# EAGLE design Lab11_445L (EAGLE 9.6.2)
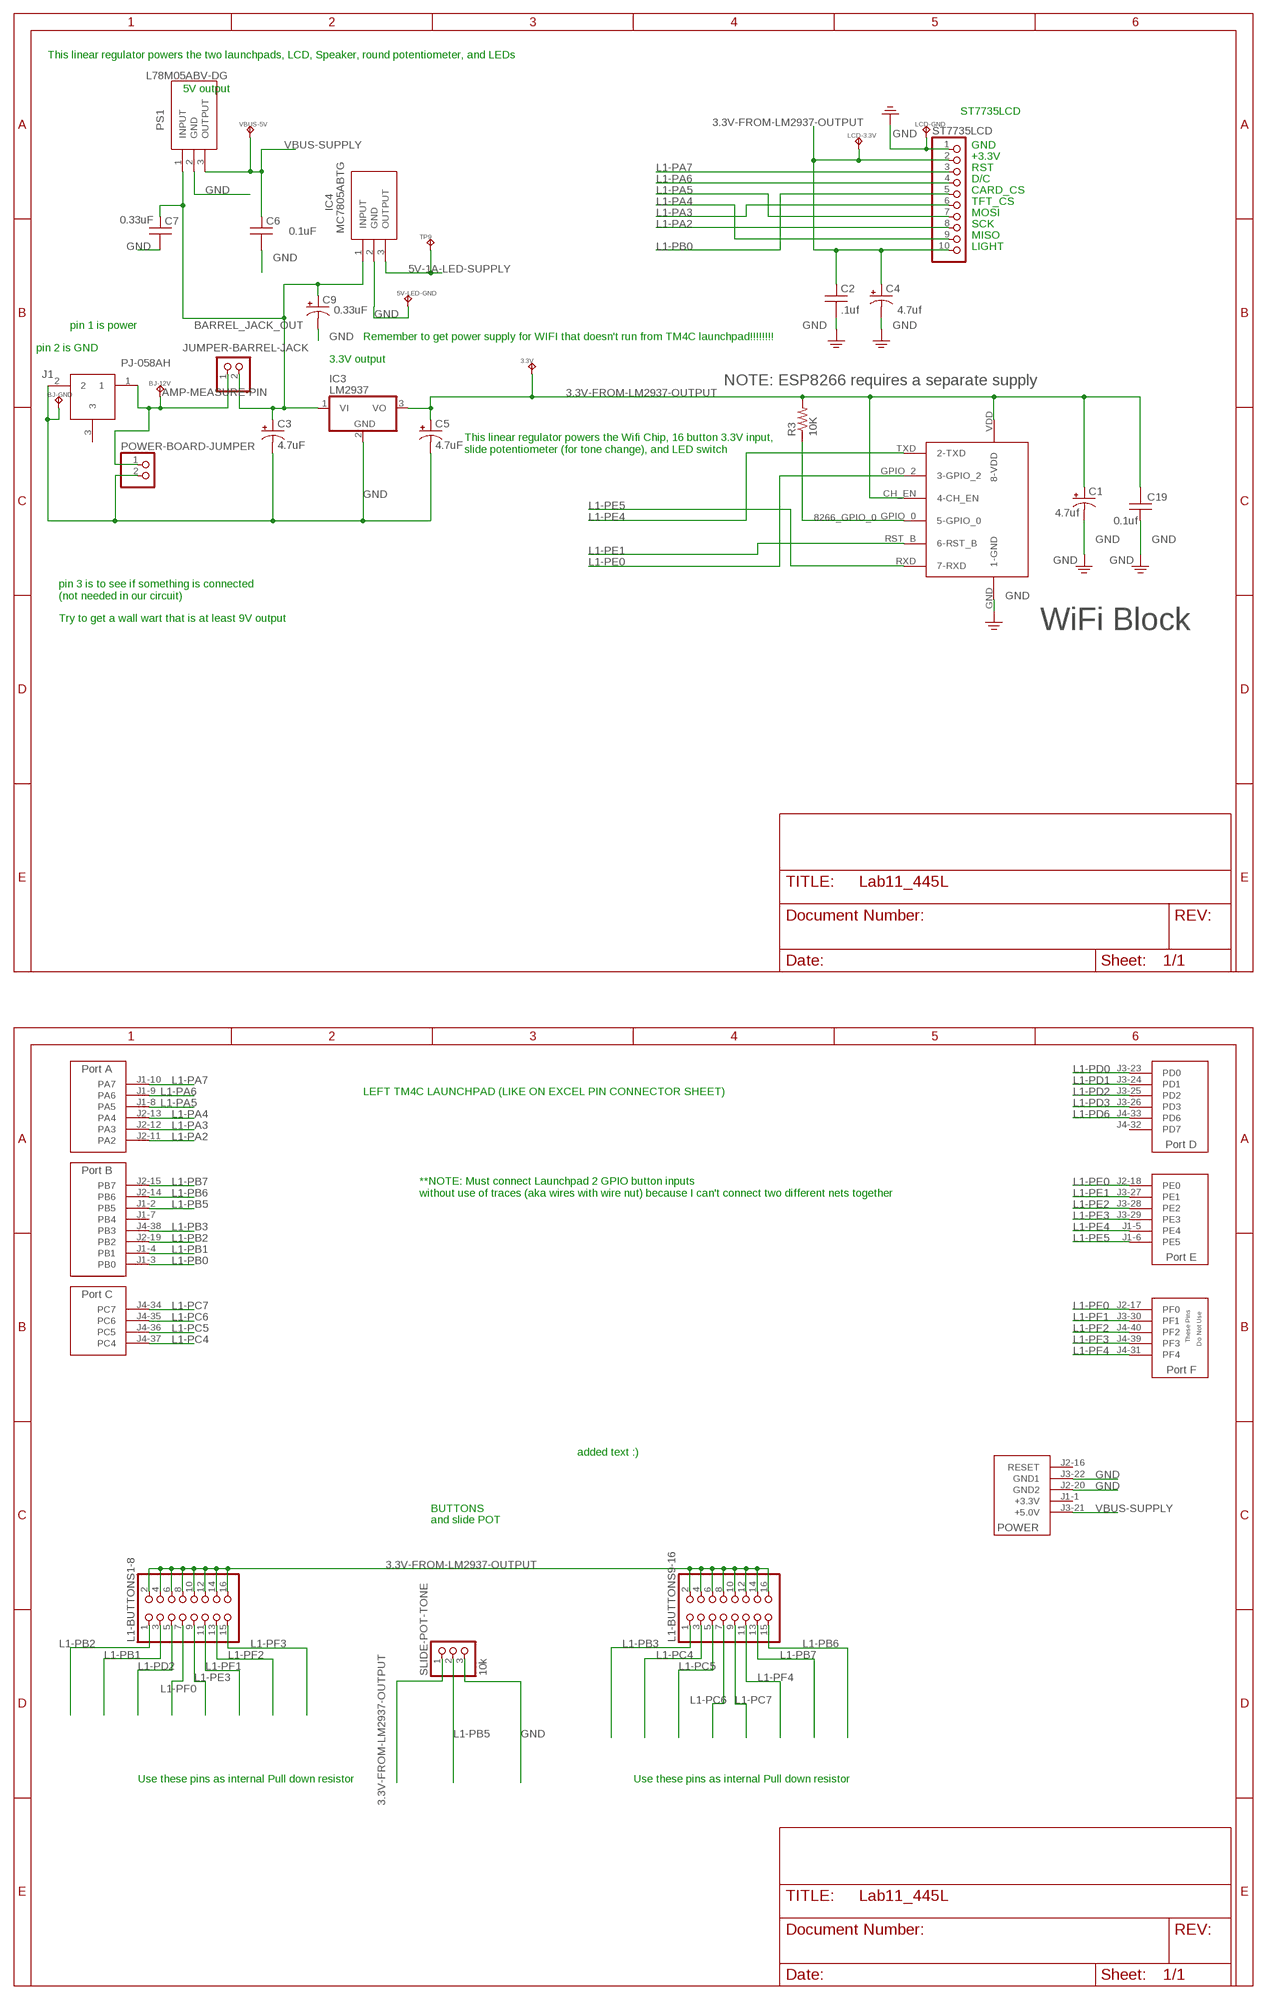
[diagram p0: schematic, sheet 1, part 1 of 2]
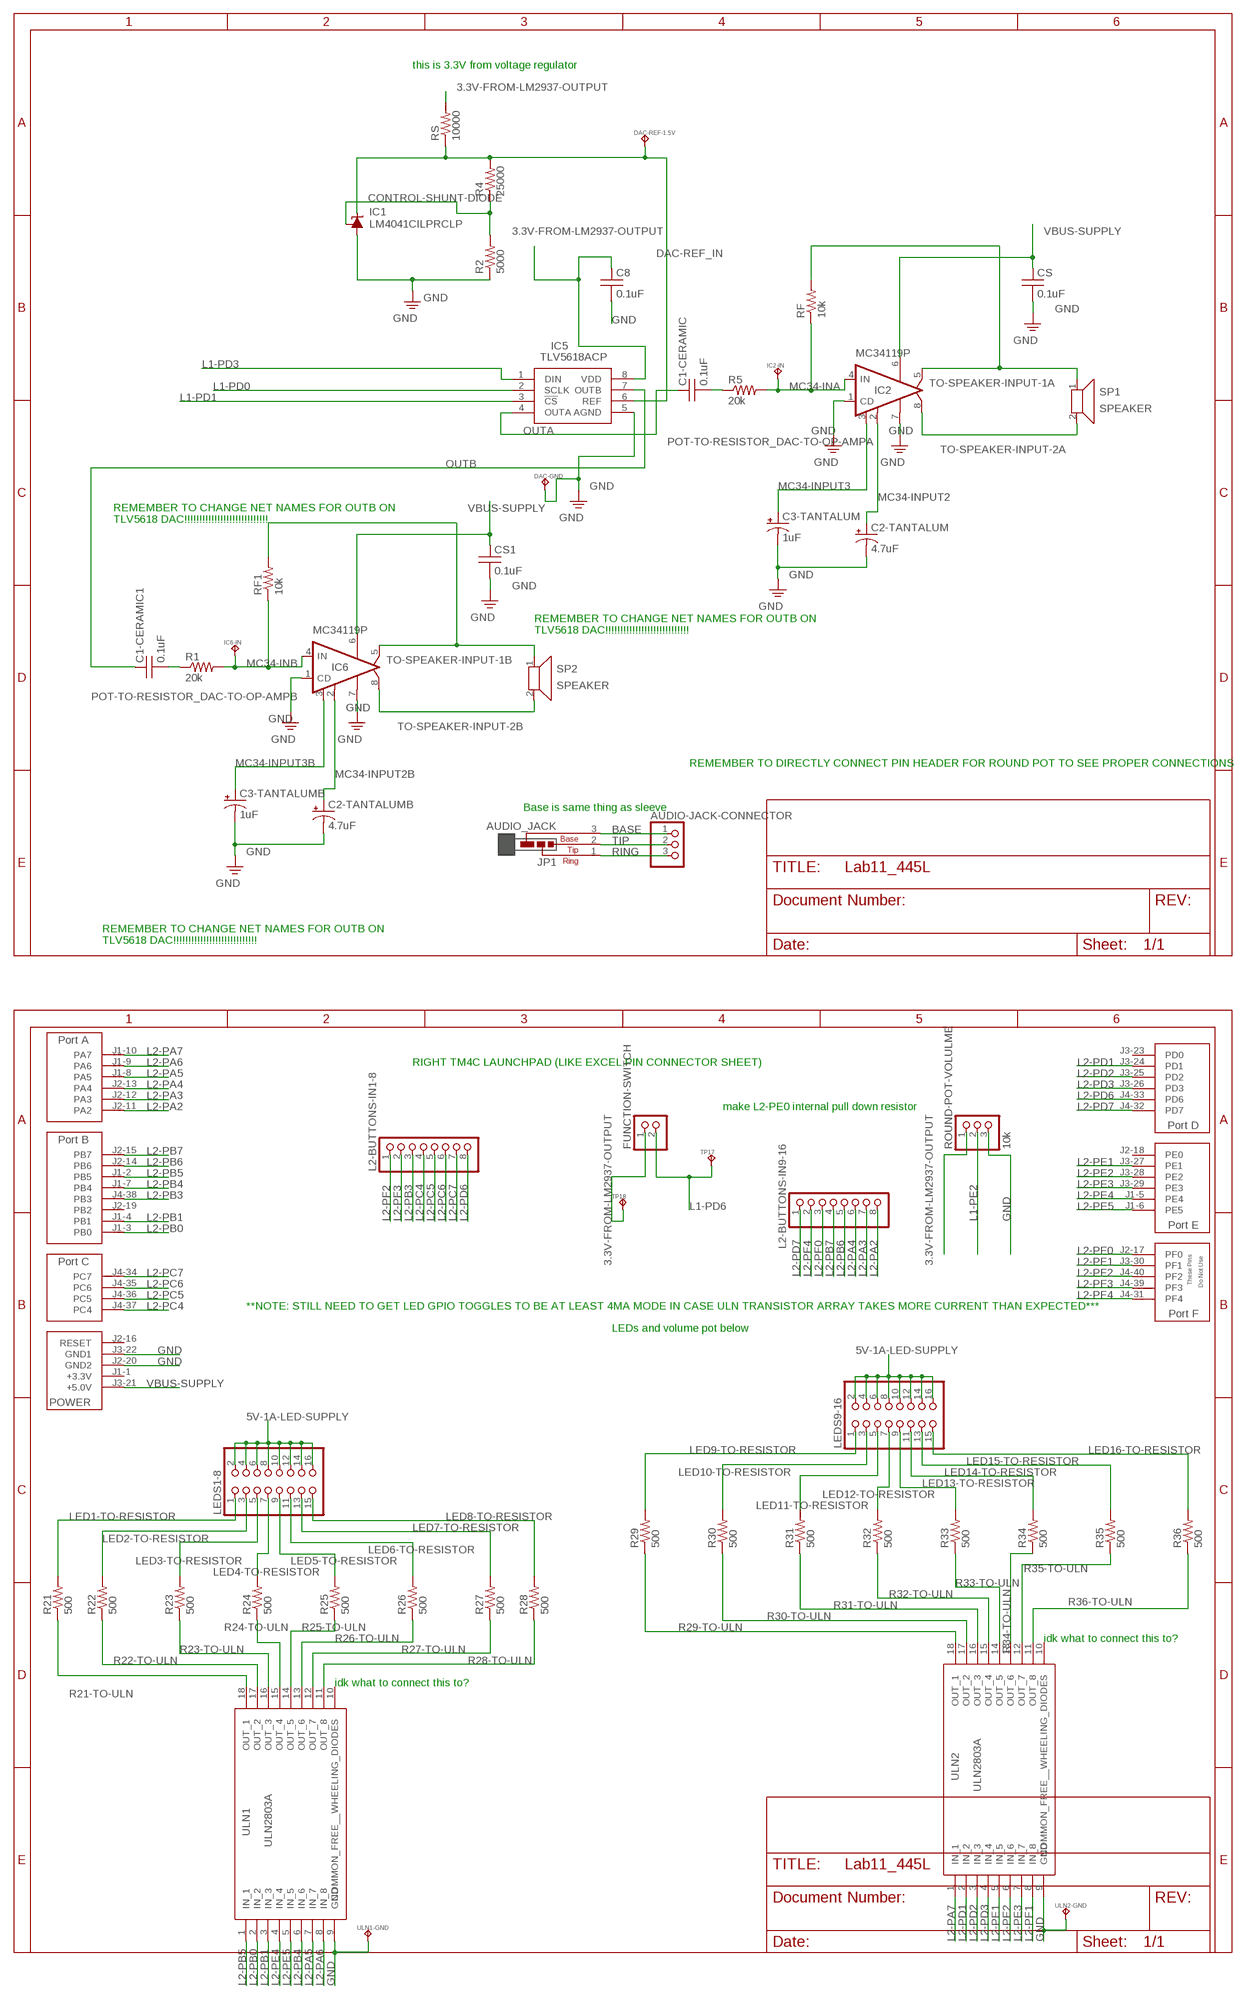
[diagram p1: schematic, sheet 1, part 2 of 2]

## Parts
3.3V  TP_KEYSTONE500X  [P1.1MM]
5V-LED-GND  TP_KEYSTONE500X  [P1.1MM]
AMP-MEASURE-PIN  PINHD-1X2  [1X02]
AUDIO-JACK-CONNECTOR  PINHD-1X3  [1X03]
BJ-12V  TP_KEYSTONE500X  [P1.1MM]
BJ-GND  TP_KEYSTONE500X  [P1.1MM]
C1  4.7uf  CAPACITOR_POLARIZEDE5-6  [CAP200MILPOLARIZED]
C1-CERAMIC  0.1uF  CAPACITOR025-024X044  [CAP100MIL]
C1-CERAMIC1  0.1uF  CAPACITOR025-024X044  [CAP100MIL]
C2  .1uf  CAPACITOR050-024X044  [CAP200MIL]
C2-TANTALUM  4.7uF  CAPACITOR_POLARIZEDE5-6  [CAP200MILPOLARIZED]
C2-TANTALUMB  4.7uF  CAPACITOR_POLARIZEDE5-6  [CAP200MILPOLARIZED]
C3  4.7uF  CAPACITOR_POLARIZEDE5-6  [CAP200MILPOLARIZED]
C3-TANTALUM  1uF  CAPACITOR_POLARIZEDE5-6  [CAP200MILPOLARIZED]
C3-TANTALUMB  1uF  CAPACITOR_POLARIZEDE5-6  [CAP200MILPOLARIZED]
C4  4.7uf  CAPACITOR_POLARIZEDE5-6  [CAP200MILPOLARIZED]
C5  4.7uF  CAPACITOR_POLARIZEDE5-6  [CAP200MILPOLARIZED]
C6  0.1uF  CAPACITOR050-024X044  [CAP200MIL]
C7  0.33uF  CAPACITOR050-024X044  [CAP200MIL]
C8  0.1uF  CAPACITOR025-024X044  [CAP100MIL]
C9  0.33uF  CAPACITOR_POLARIZEDE5-6  [CAP200MILPOLARIZED]
C19  0.1uf  CAPACITOR050-024X044  [CAP200MIL]
CS  0.1uF  CAPACITOR025-024X044  [CAP100MIL]
CS1  0.1uF  CAPACITOR025-024X044  [CAP100MIL]
DAC-GND  TP_KEYSTONE500X  [P1.1MM]
DAC-REF-1.5V  TP_KEYSTONE500X  [P1.1MM]
FUNCTION-SWITCH  PINHD-1X2  [1X02]
IC1  LM4041CILPRCLP  [LP_O-PBCY-W3]
IC2  MC34119P  [DIL08]
IC2-IN  TP_KEYSTONE500X  [P1.1MM]
IC3  LM2937  [TO220]
IC4  MC7805ABTG  [TO254P482X997X2018-3P]
IC5  TLV5618ACP  [DIP794W53P254L959H508Q8N]
IC6  MC34119P  [DIL08]
IC6-IN  TP_KEYSTONE500X  [P1.1MM]
J1  PJ-058AH  [PJ058AH]
JP1  AUDIO_JACK  [JACK]
L1-BUTTONS1-8  PINHD-2X8  [2X08]
L1-BUTTONS9-16  PINHD-2X8  [2X08]
L2-BUTTONS-IN1-8  PINHD-1X8  [1X08]
L2-BUTTONS-IN9-16  PINHD-1X8  [1X08]
LCD-3.3V  TP_KEYSTONE500X  [P1.1MM]
LCD-GND  TP_KEYSTONE500X  [P1.1MM]
LEDS1-8  PINHD-2X8  [2X08]
LEDS9-16  PINHD-2X8  [2X08]
POWER-BOARD-JUMPER  PINHD-1X2  [1X02]
PS1  L78M05ABV-DG  [TO255P460X1020X2008-3P]
R1  20k  RESISTOR0204/5  [RES200MIL]
R2  5000  RESISTOR0204/5  [RES200MIL]
R3  10K  RESISTOR0204/7  [RES300MIL]
R4  25000  RESISTOR0204/5  [RES200MIL]
R5  20k  RESISTOR0204/5  [RES200MIL]
R21  500  RESISTOR0204/7  [RES300MIL]
R22  500  RESISTOR0204/7  [RES300MIL]
R23  500  RESISTOR0204/7  [RES300MIL]
R24  500  RESISTOR0204/7  [RES300MIL]
R25  500  RESISTOR0204/7  [RES300MIL]
R26  500  RESISTOR0204/7  [RES300MIL]
R27  500  RESISTOR0204/7  [RES300MIL]
R28  500  RESISTOR0204/7  [RES300MIL]
R29  500  RESISTOR0204/7  [RES300MIL]
R30  500  RESISTOR0204/7  [RES300MIL]
R31  500  RESISTOR0204/7  [RES300MIL]
R32  500  RESISTOR0204/7  [RES300MIL]
R33  500  RESISTOR0204/7  [RES300MIL]
R34  500  RESISTOR0204/7  [RES300MIL]
R35  500  RESISTOR0204/7  [RES300MIL]
R36  500  RESISTOR0204/7  [RES300MIL]
RF  10k  RESISTOR0204/5  [RES200MIL]
RF1  10k  RESISTOR0204/5  [RES200MIL]
ROUND-POT-VOLULME  10k  PINHD-1X3  [1X03]
RS  10000  RESISTOR0204/5  [RES200MIL]
SLIDE-POT-TONE  10k  PINHD-1X3  [1X03]
SP1  SPEAKER  [1X02]
SP2  SPEAKER  [1X02]
ST7735LCD  PINHD-1X10  [1X10]
TP9  TP_KEYSTONE500X  [P1.1MM]
TP17  TP_KEYSTONE500X  [P1.1MM]
TP18  TP_KEYSTONE500X  [P1.1MM]
U$1  ESP_8266  [ESP8266]
U$2  TM4C_BP  [TM4C_BOOSTER_PACK]
U$3  TM4C_BP  [TM4C_BOOSTER_PACK]
ULN1  ULN2803A  [DIP850W46P254L2324H393Q18N]
ULN1-GND  TP_KEYSTONE500X  [P1.1MM]
ULN2  ULN2803A  [DIP850W46P254L2324H393Q18N]
ULN2-GND  TP_KEYSTONE500X  [P1.1MM]
VBUS-5V  TP_KEYSTONE500X  [P1.1MM]

## Nets
3.3V-FROM-LM2937-OUTPUT: 3.3V.TP C1.+ C2.1 C4.+ C5.+ C8.1 C19.2 FUNCTION-SWITCH.1 IC3.3(VO) IC5.8(VDD) L1-BUTTONS1-8.2 L1-BUTTONS1-8.4 L1-BUTTONS1-8.6 L1-BUTTONS1-8.8 L1-BUTTONS1-8.10 L1-BUTTONS1-8.12 L1-BUTTONS1-8.14 L1-BUTTONS1-8.16 L1-BUTTONS9-16.2 L1-BUTTONS9-16.4 L1-BUTTONS9-16.6 L1-BUTTONS9-16.8 L1-BUTTONS9-16.10 L1-BUTTONS9-16.12 L1-BUTTONS9-16.14 L1-BUTTONS9-16.16 LCD-3.3V.TP R3.2 ROUND-POT-VOLULME.1 RS.2 SLIDE-POT-TONE.1 ST7735LCD.2 ST7735LCD.10 TP18.TP U$1.CH_EN(4-CH_EN) U$1.VDD(8-VDD)
5V-1A-LED-SUPPLY: IC4.3(OUTPUT) LEDS1-8.2 LEDS1-8.4 LEDS1-8.6 LEDS1-8.8 LEDS1-8.10 LEDS1-8.12 LEDS1-8.14 LEDS1-8.16 LEDS9-16.2 LEDS9-16.4 LEDS9-16.6 LEDS9-16.8 LEDS9-16.10 LEDS9-16.12 LEDS9-16.14 LEDS9-16.16 TP9.TP
8266_GPIO_0: R3.1 U$1.GPIO_0(5-GPIO_0)
BARREL_JACK_OUT: AMP-MEASURE-PIN.1 BJ-12V.TP J1.1 POWER-BOARD-JUMPER.1
BASE: AUDIO-JACK-CONNECTOR.1 JP1.3(BASE)
CONTROL-SHUNT-DIODE: IC1.1(FB) R2.2 R4.1
DAC-REF_IN: DAC-REF-1.5V.TP IC1.2(C) IC5.6(REF) R4.2 RS.1
GND: 5V-LED-GND.TP BJ-GND.TP C1.- C2-TANTALUM.- C2-TANTALUMB.- C2.2 C3-TANTALUM.- C3-TANTALUMB.- C3.- C4.- C5.- C6.2 C7.2 C8.2 C9.- C19.1 CS1.2 CS.2 DAC-GND.TP IC1.3(A) IC2.1(CD) IC2.7(GND) IC3.2(GND) IC4.2(GND) IC5.5(AGND) IC6.1(CD) IC6.7(GND) J1.2 LCD-GND.TP POWER-BOARD-JUMPER.2 PS1.2(GND) R2.1 ROUND-POT-VOLULME.3 SLIDE-POT-TONE.3 ST7735LCD.1 U$1.GND(1-GND) U$2.J2-20(GND2) U$2.J3-22(GND1) U$3.J2-20(GND2) U$3.J3-22(GND1) ULN1-GND.TP ULN1.9(GND) ULN2-GND.TP ULN2.9(GND)
JUMPER-BARREL-JACK: AMP-MEASURE-PIN.2 C3.+ C7.1 C9.+ IC3.1(VI) IC4.1(INPUT) PS1.1(INPUT)
L1-PA2: ST7735LCD.8 U$2.J2-11(PA2)
L1-PA3: ST7735LCD.6 U$2.J2-12(PA3)
L1-PA4: ST7735LCD.9 U$2.J2-13(PA4)
L1-PA5: ST7735LCD.7 U$2.J1-8(PA5)
L1-PA6: ST7735LCD.4 U$2.J1-9(PA6)
L1-PA7: ST7735LCD.3 U$2.J1-10(PA7)
L1-PB0: ST7735LCD.5 U$2.J1-3(PB0)
L1-PB1: L1-BUTTONS1-8.3 U$2.J1-4(PB1)
L1-PB2: L1-BUTTONS1-8.1 U$2.J2-19(PB2)
L1-PB3: L1-BUTTONS9-16.1 U$2.J4-38(PB3)
L1-PB5: SLIDE-POT-TONE.2 U$2.J1-2(PB5)
L1-PB6: L1-BUTTONS9-16.15 U$2.J2-14(PB6)
L1-PB7: L1-BUTTONS9-16.13 U$2.J2-15(PB7)
L1-PC4: L1-BUTTONS9-16.3 U$2.J4-37(PC4)
L1-PC5: L1-BUTTONS9-16.5 U$2.J4-36(PC5)
L1-PC6: L1-BUTTONS9-16.7 U$2.J4-35(PC6)
L1-PC7: L1-BUTTONS9-16.9 U$2.J4-34(PC7)
L1-PD0: IC5.2(SCLK) U$2.J3-23(PD0)
L1-PD1: IC5.3(!CS) U$2.J3-24(PD1)
L1-PD2: L1-BUTTONS1-8.5 U$2.J3-25(PD2)
L1-PD3: IC5.1(DIN) U$2.J3-26(PD3)
L1-PD6: FUNCTION-SWITCH.2 TP17.TP U$2.J4-33(PD6)
L1-PE0: U$1.GPIO_2(3-GPIO_2) U$2.J2-18(PE0)
L1-PE1: U$1.RST_B(6-RST_B) U$2.J3-27(PE1)
L1-PE2: ROUND-POT-VOLULME.2 U$2.J3-28(PE2)
L1-PE3: L1-BUTTONS1-8.9 U$2.J3-29(PE3)
L1-PE4: U$1.TXD(2-TXD) U$2.J1-5(PE4)
L1-PE5: U$1.RXD(7-RXD) U$2.J1-6(PE5)
L1-PF0: L1-BUTTONS1-8.7 U$2.J2-17(PF0)
L1-PF1: L1-BUTTONS1-8.11 U$2.J3-30(PF1)
L1-PF2: L1-BUTTONS1-8.13 U$2.J4-40(PF2)
L1-PF3: L1-BUTTONS1-8.15 U$2.J4-39(PF3)
L1-PF4: L1-BUTTONS9-16.11 U$2.J4-31(PF4)
L2-PA2: L2-BUTTONS-IN9-16.8 U$3.J2-11(PA2)
L2-PA3: L2-BUTTONS-IN9-16.7 U$3.J2-12(PA3)
L2-PA4: L2-BUTTONS-IN9-16.6 U$3.J2-13(PA4)
L2-PA5: U$3.J1-8(PA5) ULN1.7(IN_7)
L2-PA6: U$3.J1-9(PA6) ULN1.8(IN_8)
L2-PA7: U$3.J1-10(PA7) ULN2.1(IN_1)
L2-PB0: U$3.J1-3(PB0) ULN1.2(IN_2)
L2-PB1: U$3.J1-4(PB1) ULN1.3(IN_3)
L2-PB3: L2-BUTTONS-IN1-8.3 U$3.J4-38(PB3)
L2-PB4: U$3.J1-7(PB4) ULN1.6(IN_6)
L2-PB5: U$3.J1-2(PB5) ULN1.1(IN_1)
L2-PB6: L2-BUTTONS-IN9-16.5 U$3.J2-14(PB6)
L2-PB7: L2-BUTTONS-IN9-16.4 U$3.J2-15(PB7)
L2-PC4: L2-BUTTONS-IN1-8.4 U$3.J4-37(PC4)
L2-PC5: L2-BUTTONS-IN1-8.5 U$3.J4-36(PC5)
L2-PC6: L2-BUTTONS-IN1-8.6 U$3.J4-35(PC6)
L2-PC7: L2-BUTTONS-IN1-8.7 U$3.J4-34(PC7)
L2-PD1: U$3.J3-24(PD1) ULN2.2(IN_2)
L2-PD2: U$3.J3-25(PD2) ULN2.3(IN_3)
L2-PD3: U$3.J3-26(PD3) ULN2.4(IN_4)
L2-PD6: L2-BUTTONS-IN1-8.8 U$3.J4-33(PD6)
L2-PD7: L2-BUTTONS-IN9-16.1 U$3.J4-32(PD7)
L2-PE1: U$3.J3-27(PE1) ULN2.5(IN_5)
L2-PE2: U$3.J3-28(PE2) ULN2.6(IN_6)
L2-PE3: U$3.J3-29(PE3) ULN2.7(IN_7)
L2-PE4: U$3.J1-5(PE4) ULN1.4(IN_4)
L2-PE5: U$3.J1-6(PE5) ULN1.5(IN_5)
L2-PF0: L2-BUTTONS-IN9-16.3 U$3.J2-17(PF0)
L2-PF1: U$3.J3-30(PF1) ULN2.8(IN_8)
L2-PF2: L2-BUTTONS-IN1-8.1 U$3.J4-40(PF2)
L2-PF3: L2-BUTTONS-IN1-8.2 U$3.J4-39(PF3)
L2-PF4: L2-BUTTONS-IN9-16.2 U$3.J4-31(PF4)
LED1-TO-RESISTOR: LEDS1-8.1 R21.2
LED2-TO-RESISTOR: LEDS1-8.3 R22.2
LED3-TO-RESISTOR: LEDS1-8.5 R23.2
LED4-TO-RESISTOR: LEDS1-8.7 R24.2
LED5-TO-RESISTOR: LEDS1-8.9 R25.2
LED6-TO-RESISTOR: LEDS1-8.11 R26.2
LED7-TO-RESISTOR: LEDS1-8.13 R27.2
LED8-TO-RESISTOR: LEDS1-8.15 R28.2
LED9-TO-RESISTOR: LEDS9-16.1 R29.2
LED10-TO-RESISTOR: LEDS9-16.3 R30.2
LED11-TO-RESISTOR: LEDS9-16.5 R31.2
LED12-TO-RESISTOR: LEDS9-16.7 R32.2
LED13-TO-RESISTOR: LEDS9-16.9 R33.2
LED14-TO-RESISTOR: LEDS9-16.11 R34.2
LED15-TO-RESISTOR: LEDS9-16.13 R35.2
LED16-TO-RESISTOR: LEDS9-16.15 R36.2
MC34-INA: IC2-IN.TP IC2.4(IN) R5.2 RF.1
MC34-INB: IC6-IN.TP IC6.4(IN) R1.2 RF1.1
MC34-INPUT2: C2-TANTALUM.+ IC2.2(FC2)
MC34-INPUT2B: C2-TANTALUMB.+ IC6.2(FC2)
MC34-INPUT3: C3-TANTALUM.+ IC2.3(FC1)
MC34-INPUT3B: C3-TANTALUMB.+ IC6.3(FC1)
OUTA: C1-CERAMIC.1 IC5.4(OUTA)
OUTB: C1-CERAMIC1.1 IC5.7(OUTB)
POT-TO-RESISTOR_DAC-TO-OP-AMPA: C1-CERAMIC.2 R5.1
POT-TO-RESISTOR_DAC-TO-OP-AMPB: C1-CERAMIC1.2 R1.1
R21-TO-ULN: R21.1 ULN1.18(OUT_1)
R22-TO-ULN: R22.1 ULN1.17(OUT_2)
R23-TO-ULN: R23.1 ULN1.16(OUT_3)
R24-TO-ULN: R24.1 ULN1.15(OUT_4)
R25-TO-ULN: R25.1 ULN1.14(OUT_5)
R26-TO-ULN: R26.1 ULN1.13(OUT_6)
R27-TO-ULN: R27.1 ULN1.12(OUT_7)
R28-TO-ULN: R28.1 ULN1.11(OUT_8)
R29-TO-ULN: R29.1 ULN2.18(OUT_1)
R30-TO-ULN: R30.1 ULN2.17(OUT_2)
R31-TO-ULN: R31.1 ULN2.16(OUT_3)
R32-TO-ULN: R32.1 ULN2.15(OUT_4)
R33-TO-ULN: R33.1 ULN2.14(OUT_5)
R34-TO-ULN: R34.1 ULN2.13(OUT_6)
R35-TO-ULN: R35.1 ULN2.12(OUT_7)
R36-TO-ULN: R36.1 ULN2.11(OUT_8)
RING: AUDIO-JACK-CONNECTOR.3 JP1.1(RING)
TIP: AUDIO-JACK-CONNECTOR.2 JP1.2(TIP)
TO-SPEAKER-INPUT-1A: IC2.5(VO1) RF.2 SP1.1
TO-SPEAKER-INPUT-1B: IC6.5(VO1) RF1.2 SP2.1
TO-SPEAKER-INPUT-2A: IC2.8(VO2) SP1.2
TO-SPEAKER-INPUT-2B: IC6.8(VO2) SP2.2
VBUS-SUPPLY: C6.1 CS1.1 CS.1 IC2.6(VCC) IC6.6(VCC) PS1.3(OUTPUT) U$2.J3-21(+5.0V) U$3.J3-21(+5.0V) VBUS-5V.TP
Unconnected: J1.3 U$2.J1-1(+3.3V) U$2.J1-7(PB4) U$2.J2-16(RESET) U$2.J4-32(PD7) U$3.J1-1(+3.3V) U$3.J2-16(RESET) U$3.J2-18(PE0) U$3.J2-19(PB2) U$3.J3-23(PD0) ULN1.10(COMMON_FREE__WHEELING_DIODES) ULN2.10(COMMON_FREE__WHEELING_DIODES)

## Notes on the sheet
- This linear regulator powers the two launchpads, LCD, Speaker, round potentiometer, and LEDs
- this is 3.3V from voltage regulator
- 5V output
- ST7735LCD
- GND
- +3.3V
- RST
- D/C
- CARD_CS
- TFT_CS
- MOSI
- SCK
- MISO
- LIGHT
- pin 1 is power
- Remember to get power supply for WIFI that doesn't run from TM4C launchpad!!!!!!!!
- pin 2 is GND
- 3.3V output
- NOTE: ESP8266 requires a separate supply
- This linear regulator powers the Wifi Chip, 16 button 3.3V input, 
  slide potentiometer (for tone change), and LED switch
- REMEMBER TO CHANGE NET NAMES FOR OUTB ON 
  TLV5618 DAC!!!!!!!!!!!!!!!!!!!!!!!!!!!!
- pin 3 is to see if something is connected 
  (not needed in our circuit)
- Try to get a wall wart that is at least 9V output
- WiFi Block
- REMEMBER TO CHANGE NET NAMES FOR OUTB ON 
  TLV5618 DAC!!!!!!!!!!!!!!!!!!!!!!!!!!!!
- REMEMBER TO DIRECTLY CONNECT PIN HEADER FOR ROUND POT TO SEE PROPER CONNECTIONS
- Base is same thing as sleeve
- REMEMBER TO CHANGE NET NAMES FOR OUTB ON 
  TLV5618 DAC!!!!!!!!!!!!!!!!!!!!!!!!!!!!
- RIGHT TM4C LAUNCHPAD (LIKE EXCEL PIN CONNECTOR SHEET)
- LEFT TM4C LAUNCHPAD (LIKE ON EXCEL PIN CONNECTOR SHEET)
- make L2-PE0 internal pull down resistor
- **NOTE: Must connect Launchpad 2 GPIO button inputs 
  without use of traces (aka wires with wire nut) because I can't connect two different nets together
- **NOTE: STILL NEED TO GET LED GPIO TOGGLES TO BE AT LEAST 4MA MODE IN CASE ULN TRANSISTOR ARRAY TAKES MORE CURRENT THAN EXPECTED***
- LEDs and volume pot below
- added text :)
- BUTTONS
- and slide POT
- idk what to connect this to?
- idk what to connect this to?
- Use these pins as internal Pull down resistor | Use these pins as internal Pull down resistor

## Library data of the parts
3.3V 5V-LED-GND BJ-12V BJ-GND DAC-GND DAC-REF-1.5V IC2-IN IC6-IN LCD-3.3V LCD-GND TP9 TP17 TP18 ULN1-GND ULN2-GND VBUS-5V = EE445L:TP: Test pad Test point, black, Keystone Electronics 5001, Digikey 5001K-ND Test point, orange, Keystone Electronics 5003, Digikey 5003K-ND Test point, yellow, Keystone Electronics 5004, Digikey 5004K-ND Test point, white, Keystone Electronics 5002, Digikey 5002K-ND Test point, red, Keystone Electronics 5000, Digikey 5000K-ND
AMP-MEASURE-PIN FUNCTION-SWITCH POWER-BOARD-JUMPER = EE445L:PINHD-1X2: PIN HEADER
AUDIO-JACK-CONNECTOR ROUND-POT-VOLULME SLIDE-POT-TONE = EE445L:PINHD-1X3: PIN HEADER
C1 C2-TANTALUM C2-TANTALUMB C3 C3-TANTALUM C3-TANTALUMB C4 C5 C9 = EE445L:CAPACITOR_POLARIZED: POLARIZED CAPACITOR, American symbol
C1-CERAMIC C1-CERAMIC1 C2 C6-C8 C19 CS CS1 = EE445L:CAPACITOR: CAPACITOR, American symbol
IC1 = EE445L:LM4041CILPR: PRECISION MICROPOWER SHUNT VOLTAGE REFERENCE Adjustable Output Source: http://focus.ti.com/lit/ds/slcs146e/slcs146e.pdf LM4041CILPR Let R1 be the resistor from Vref to +3.3V Let R2 be the resistor from Vref to FB Let R3 be the resistor from FB to ground Vref = 1.23*(1+R3/R2) Iref=(3.3V-Vref)/R1 - 100uA; MPN: LM4041CILP; OC_FARNELL: 1673945; OC_NEWARK: 50M8856
IC2 IC6 = EE445L:MC34119: Low Power Audio Amplifier Motorola
IC3 = EE445L:LM2937: LM2937-2.5, LM2937-3.3 400mA and 500mA Voltage Regulators Source: http://cache.national.com/ds/LM/LM2937-2.5.pdf
IC4 = MC7805ABTG:MC7805ABTG: Voltage Regulator 1A 5V 2% 35Vin TO-220 ON Semiconductor MC7805ABTG, Single Linear Voltage Regulator, 1A 5 V, +/-2%, 3-Pin TO-220 Source: Datasheet <http://www.onsemi.com/pub/Collateral/MC7800-D.PDF>; DESCRIPTION: Voltage Regulator 1A 5V 2% 35Vin TO-220 ON Semiconductor MC7805ABTG, Single Linear Voltage Regulator, 1A 5 V, +/-2%, 3-Pin TO-220; HEIGHT: 4.82mm; MANUFACTURER_NAME: ON Semiconductor; MANUFACTURER_PART_NUMBER: MC7805ABTG; MOUSER_PART_NUMBER: 863-MC7805ABTG; MOUSER_PRICE-STOCK: https://www.mouser.co.uk/ProductDetail/onsemi/MC7805ABTG?qs=%252B9%2Fcbd0IE0RLGUepYBL%2Fmg%3D%3D
IC5 = TLV5618ACP:TLV5618ACP: 12-Bit, 2.5 us Dual DAC, Serial Input, Pgrmable Settling Time, Q temp available Source: Datasheet <http://www.ti.com/lit/ds/symlink/tlv5618a.pdf>; DESCRIPTION: 12-Bit, 2.5 us Dual DAC, Serial Input, Pgrmable Settling Time, Q temp available; HEIGHT: 5.08mm; MANUFACTURER_NAME: Texas Instruments; MANUFACTURER_PART_NUMBER: TLV5618ACP; MOUSER_PART_NUMBER: 595-TLV5618ACP; MOUSER_PRICE-STOCK: https://www.mouser.co.uk/ProductDetail/Texas-Instruments/TLV5618ACP?qs=m96fseALk3UtMGk%252BxtLEkA%3D%3D
J1 = PJ-058AH:PJ-058AH: DC Power Connectors Power Jacks Source: Datasheet <http://www.cui.com/product/resource/digikeypdf/pj-058ah.pdf>; DESCRIPTION: DC Power Connectors Power Jacks; HEIGHT: 11mm; MANUFACTURER_NAME: CUI Inc.; MANUFACTURER_PART_NUMBER: PJ-058AH; MOUSER_PART_NUMBER: 490-PJ-058AH; MOUSER_PRICE-STOCK: https://www.mouser.co.uk/ProductDetail/CUI-Devices/PJ-058AH?qs=WyjlAZoYn53EeE%252BXtzGmBw%3D%3D
JP1 = EE445L:AUDIO_JACK: Audio Jack Stereo Jack 3pin 3.5mm, CUI, SJ1-3553NG, CP1-3553NG-ND; OC_FARNELL: unknown; OC_NEWARK: unknown
L1-BUTTONS1-8 L1-BUTTONS9-16 LEDS1-8 LEDS9-16 = EE445L:PINHD-2X8: PIN HEADER
L2-BUTTONS-IN1-8 L2-BUTTONS-IN9-16 = EE445L:PINHD-1X8: PIN HEADER
PS1 = L78M05ABV-DG:L78M05ABV-DG: 5V Precision 500mA Regulator TO-220 STMicroelectronics L78Mxx L78M05ABV-DG, Single Linear Voltage Regulator, 350mA 5.2 V, 3-Pin TO-220 Source: Datasheet <https://componentsearchengine.com/Datasheets/1/L78M05ABV-DG.pdf>; DESCRIPTION: 5V Precision 500mA Regulator TO-220 STMicroelectronics L78Mxx L78M05ABV-DG, Single Linear Voltage Regulator, 350mA 5.2 V, 3-Pin TO-220; HEIGHT: 4.6mm; MANUFACTURER_NAME: STMicroelectronics; MANUFACTURER_PART_NUMBER: L78M05ABV-DG; MOUSER_PART_NUMBER: 511-L78M05ABV-DG; MOUSER_PRICE-STOCK: https://www.mouser.co.uk/ProductDetail/STMicroelectronics/L78M05ABV-DG?qs=WHlX%252B%252B9%2FRwDCteR6J2ExhA%3D%3D
R1-R5 R21-R36 RF RF1 RS = EE445L:RESISTOR: RESISTOR, American symbol
SP1 SP2 = EE445L:SPEAKER: Speaker Connected off PCB with two wires. 32-ohm speaker, AllElectronics, SK-230, http://www.allelectronics.com/make-a-store/item/sk-230/20-mm-32-ohm-speaker/1.html
ST7735LCD = EE445L:PINHD-1X10: PIN HEADER
U$1 = EE445L:ESP_8266
U$2 U$3 = EE445L:TM4C_BP
ULN1 ULN2 = ULN2803A:ULN2803A: Trans Darlington NPN 50V 0.5A PDIP18 STMicroelectronics ULN2803A Octal NPN Darlington Transistor Array, 0.5 A 50 V HFE:1000, 18-Pin PDIP Source: Datasheet <http://www.st.com/web/en/resource/technical/document/datasheet/CD00000179.pdf>; DESCRIPTION: Trans Darlington NPN 50V 0.5A PDIP18 STMicroelectronics ULN2803A Octal NPN Darlington Transistor Array, 0.5 A 50 V HFE:1000, 18-Pin PDIP; HEIGHT: 3.93mm; MANUFACTURER_NAME: STMicroelectronics; MANUFACTURER_PART_NUMBER: ULN2803A; MOUSER_PART_NUMBER: 511-ULN2803A; MOUSER_PRICE-STOCK: https://www.mouser.co.uk/ProductDetail/STMicroelectronics/ULN2803A?qs=FOlmdCx%252BAA1lVc%2FYEXA4pg%3D%3D

## Board
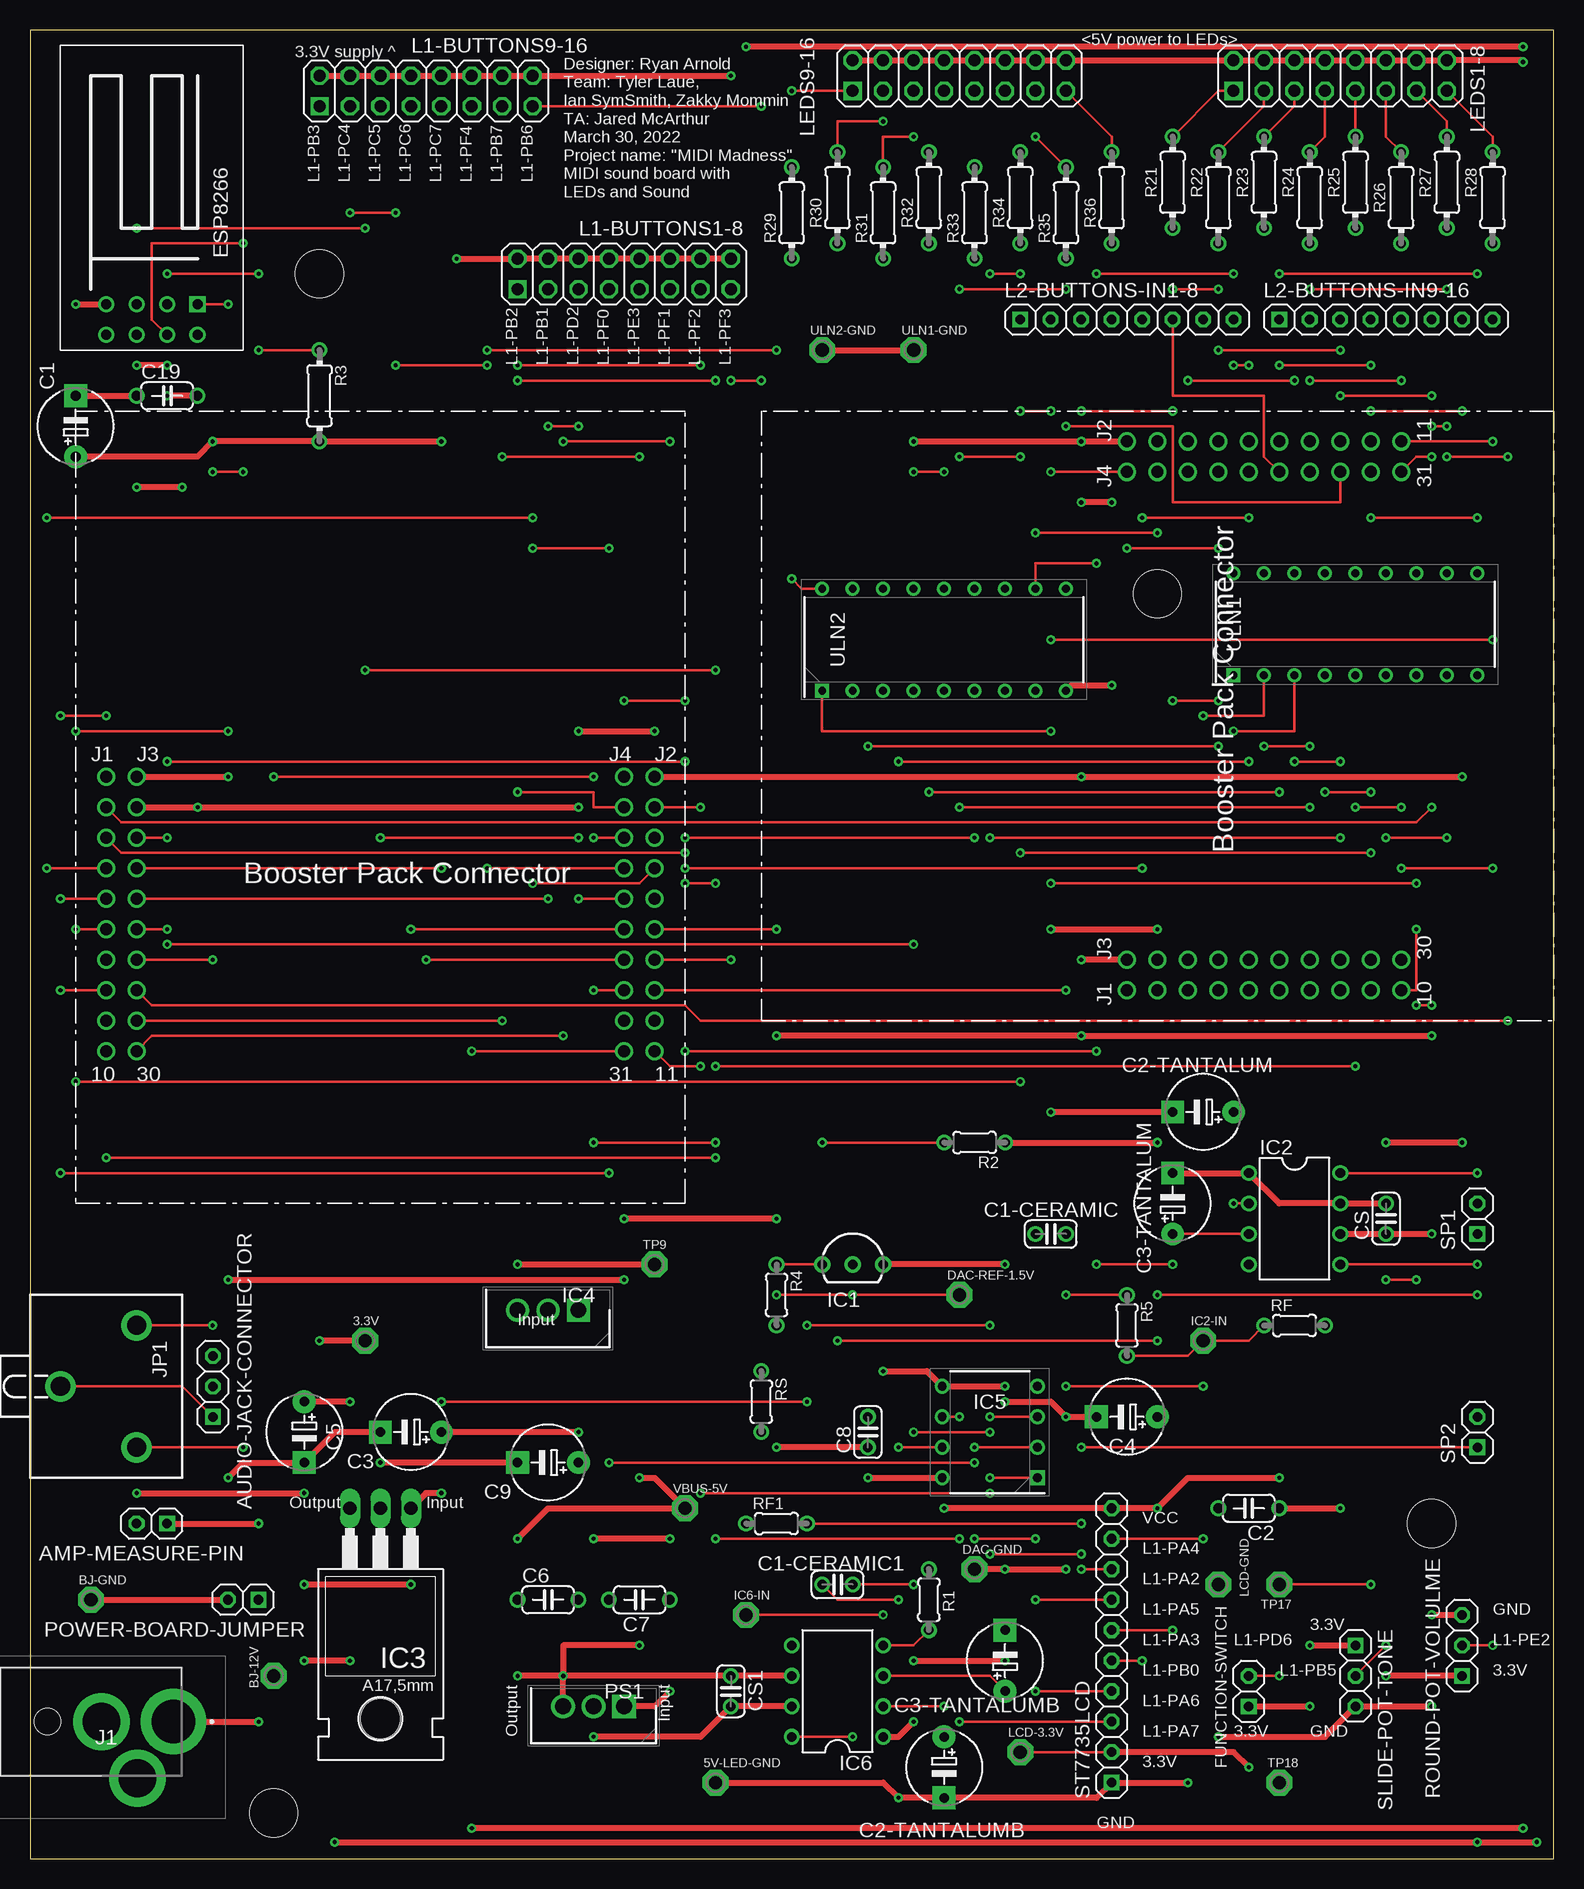
[diagram p2: board, top side]
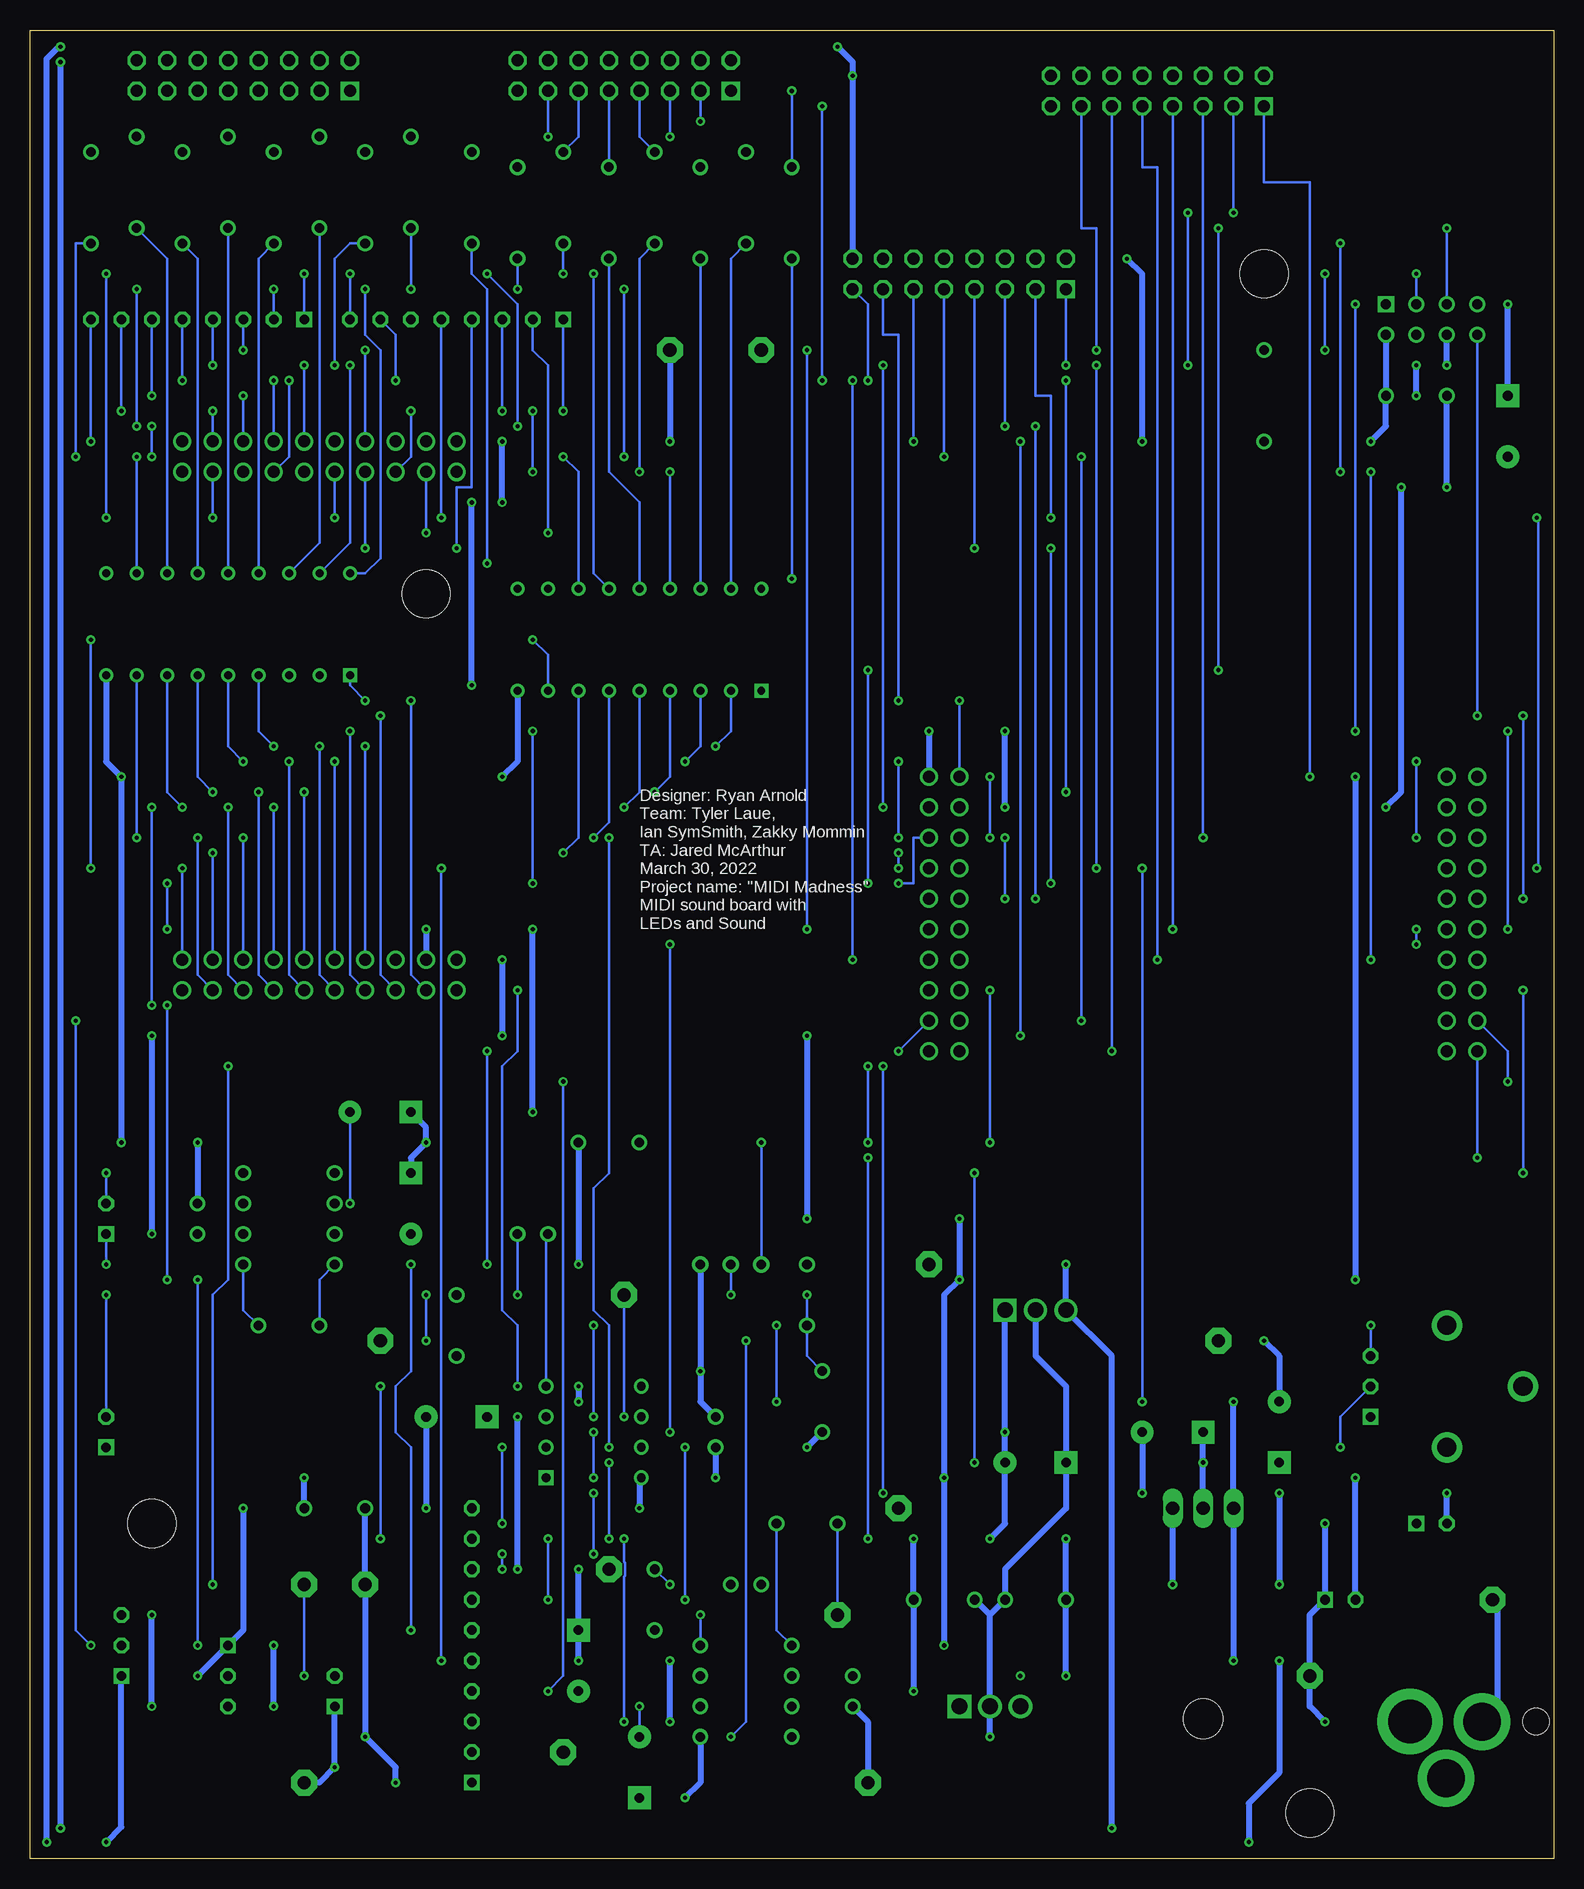
[diagram p3: board, bottom side, seen from below]

Size 127 x 152.4 mm. Coordinates in mm from the lower left corner, seen from the top.
Outline: 0,0 127,0 127,152.4 0,152.4 0,0
Copper layers (1*16): Top 0.035mm / dielectric 1.5mm / Bottom 0.035mm
Design rules "default": minimum track width 6mil, minimum drill 0.35mm, track to track 6mil, track to pad 6mil, pad to pad 6mil, via to via 6mil, smd to smd 6mil, copper to edge 40mil, drill to drill 6mil, minimum pad ring 10mil, minimum via ring 8mil, stop-mask expansion 4mil, vias tented up to drill 0mil, thermal gap 10mil
Holes 4 mm at 24.13,132.08 20.32,3.81 116.84,27.94 93.98,105.41

### Footprints (pad centres in the part's own frame; a part is rotated, then mirrored left to right if it is on the bottom)
P1.1MM = drill 1.1 pad 2.159 octagon: TP 0,0
1X02 = drill 0.8 square: 1 -1.27,0 | drill 0.8 octagon: 2 1.27,0
1X03 = drill 0.8 square: 1 -2.54,0 | drill 0.8 octagon: 2 0,0; 3 2.54,0
CAP200MILPOLARIZED = drill 0.8 pad 1.905: + -2.54,0 | drill 0.8 pad 1.905 square: - 2.54,0
CAP100MIL = drill 0.8: 1 -1.27,0; 2 1.27,0
CAP200MIL = drill 0.8: 1 -2.54,0; 2 2.54,0
LP_O-PBCY-W3 = drill 0.8 pad 1.4: 1 -2.54,0; 2 0,0; 3 2.54,0
DIL08 = drill 0.813 pad 1.27: 1 -3.81,-3.81; 2 -1.27,-3.81; 3 1.27,-3.81; 4 3.81,-3.81; 5 3.81,3.81; 6 1.27,3.81; 7 -1.27,3.81; 8 -3.81,3.81
TO220 = drill 1.1 long: 1 -2.54,-6.35; 2 0,-6.35; 3 2.54,-6.35 | hole 3.302: 0,11.176
TO254P482X997X2018-3P = drill 1.29 pad 1.935 square: 1 0,0 | drill 1.29 pad 1.935: 2 2.54,0; 3 5.08,0
DIP794W53P254L959H508Q8N = drill 0.73 pad 1.13 square: 1 -3.97,3.81 | drill 0.73 pad 1.13: 2 -3.97,1.27; 3 -3.97,-1.27; 4 -3.97,-3.81; 5 3.97,-3.81; 6 3.97,-1.27; 7 3.97,1.27; 8 3.97,3.81
PJ058AH = drill 3.64 pad 5.46: 1 14.5,0 | drill 3.162 pad 4.743: 2 8.5,0; 3 11.5,-4.7 | hole 2.2: 4,0
JACK = drill 1.587 pad 2.54: 1 -5.08,2.54; 2 5.08,2.54; 3 0,-3.81
2X08 = drill 1 square: 1 -8.89,-1.27 | drill 1 octagon: 2 -8.89,1.27; 3 -6.35,-1.27; 4 -6.35,1.27; 5 -3.81,-1.27; 6 -3.81,1.27; 7 -1.27,-1.27; 8 -1.27,1.27; 9 1.27,-1.27; 10 1.27,1.27; 11 3.81,-1.27; 12 3.81,1.27; 13 6.35,-1.27; 14 6.35,1.27; 15 8.89,-1.27; 16 8.89,1.27
1X08 = drill 0.8 square: 1 -8.89,0 | drill 0.8 octagon: 2 -6.35,0; 3 -3.81,0; 4 -1.27,0; 5 1.27,0; 6 3.81,0; 7 6.35,0; 8 8.89,0
TO255P460X1020X2008-3P = drill 1.32 pad 1.98 square: 1 0,0 | drill 1.32 pad 1.98: 2 2.55,0; 3 5.1,0
RES200MIL = drill 0.8: 1 -2.54,0; 2 2.54,0
RES300MIL = drill 0.8: 1 -3.81,0; 2 3.81,0
1X10 = drill 0.8 square: 1 -11.43,0 | drill 0.8 octagon: 2 -8.89,0; 3 -6.35,0; 4 -3.81,0; 5 -1.27,0; 6 1.27,0; 7 3.81,0; 8 6.35,0; 9 8.89,0; 10 11.43,0
ESP8266 = drill 0.85: CH_EN 1.27,-1.27; GND -1.27,-3.81; GPIO_0 -1.27,1.27; GPIO_2 -1.27,-1.27; RST_B 1.27,1.27; TXD 1.27,-3.81; VDD 1.27,3.81 | drill 0.85 square: RXD -1.27,3.81
TM4C_BOOSTER_PACK = drill 1: J1-1 0,22.86; J1-2 0,20.32; J1-3 0,17.78; J1-4 0,15.24; J1-5 0,12.7; J1-6 0,10.16; J1-7 0,7.62; J1-8 0,5.08; J1-9 0,2.54; J1-10 0,0; J2-11 45.72,0; J2-12 45.72,2.54; J2-13 45.72,5.08; J2-14 45.72,7.62; J2-15 45.72,10.16; J2-16 45.72,12.7; J2-17 45.72,15.24; J2-18 45.72,17.78; J2-19 45.72,20.32; J2-20 45.72,22.86; J3-21 2.54,22.86; J3-22 2.54,20.32; J3-23 2.54,17.78; J3-24 2.54,15.24; J3-25 2.54,12.7; J3-26 2.54,10.16; J3-27 2.54,7.62; J3-28 2.54,5.08; J3-29 2.54,2.54; J3-30 2.54,0; J4-31 43.18,0; J4-32 43.18,2.54; J4-33 43.18,5.08; J4-34 43.18,7.62; J4-35 43.18,10.16; J4-36 43.18,12.7; J4-37 43.18,15.24; J4-38 43.18,17.78; J4-39 43.18,20.32; J4-40 43.18,22.86
DIP850W46P254L2324H393Q18N = drill 0.66 pad 1.06 square: 1 -4.25,10.16 | drill 0.66 pad 1.06: 2 -4.25,7.62; 3 -4.25,5.08; 4 -4.25,2.54; 5 -4.25,0; 6 -4.25,-2.54; 7 -4.25,-5.08; 8 -4.25,-7.62; 9 -4.25,-10.16; 10 4.25,-10.16; 11 4.25,-7.62; 12 4.25,-5.08; 13 4.25,-2.54; 14 4.25,0; 15 4.25,2.54; 16 4.25,5.08; 17 4.25,7.62; 18 4.25,10.16

### Placement (x,y rotation side)
3.3V  27.94,43.18 0 top
5V-LED-GND  57.15,6.35 0 top
AMP-MEASURE-PIN  10.16,27.94 180 top
AUDIO-JACK-CONNECTOR  15.24,39.37 90 top
BJ-12V  20.32,15.24 90 top
BJ-GND  5.08,21.59 0 top
C1  3.81,119.38 90 top
C1-CERAMIC  85.09,52.07 0 top
C1-CERAMIC1  67.31,22.86 0 top
C2  101.6,29.21 180 top
C2-TANTALUM  97.79,62.23 180 top
C2-TANTALUMB  76.2,7.62 270 top
C3  31.75,35.56 180 top
C3-TANTALUM  95.25,54.61 90 top
C3-TANTALUMB  81.28,16.51 90 top
C4  91.44,36.83 180 top
C5  22.86,35.56 270 top
C6  43.18,21.59 0 top
C7  50.8,21.59 180 top
C8  69.85,35.56 90 top
C9  43.18,33.02 180 top
C19  11.43,121.92 0 top
CS  113.03,53.34 90 top
CS1  58.42,13.97 270 top
DAC-GND  78.74,24.13 0 top
DAC-REF-1.5V  77.47,46.99 0 top
FUNCTION-SWITCH  101.6,13.97 90 top
IC1  68.58,49.53 0 top
IC2  105.41,53.34 270 top
IC2-IN  97.79,43.18 0 top
IC3  29.21,22.86 180 top
IC4  45.72,45.72 180 top
IC5  80.01,35.56 180 top
IC6  67.31,13.97 90 top
IC6-IN  59.69,20.32 0 top
J1  -2.54,11.43 0 top
JP1  6.35,39.37 270 top
L1-BUTTONS1-8  49.53,132.08 0 top
L1-BUTTONS9-16  33.02,147.32 0 top
L2-BUTTONS-IN1-8  91.44,128.27 0 top
L2-BUTTONS-IN9-16  113.03,128.27 0 top
LCD-3.3V  82.55,8.89 0 top
LCD-GND  99.06,22.86 90 top
LEDS1-8  109.22,148.59 0 top
LEDS9-16  77.47,148.59 0 top
POWER-BOARD-JUMPER  17.78,21.59 180 top
PS1  49.53,12.7 180 top
R1  74.93,21.59 270 top
R2  78.74,59.69 180 top
R3  24.13,121.92 270 top
R4  62.23,46.99 270 top
R5  91.44,44.45 270 top
R21  95.25,139.7 90 top
R22  99.06,138.43 90 top
R23  102.87,139.7 90 top
R24  106.68,138.43 90 top
R25  110.49,139.7 90 top
R26  114.3,138.43 90 top
R27  118.11,139.7 90 top
R28  121.92,138.43 90 top
R29  63.5,137.16 90 top
R30  67.31,138.43 90 top
R31  71.12,137.16 90 top
R32  74.93,138.43 90 top
R33  78.74,137.16 90 top
R34  82.55,138.43 90 top
R35  86.36,137.16 90 top
R36  90.17,138.43 90 top
RF  105.41,44.45 0 top
RF1  62.23,27.94 0 top
ROUND-POT-VOLULME  119.38,17.78 90 top
RS  60.96,38.1 270 top
SLIDE-POT-TONE  110.49,15.24 270 top
SP1  120.65,53.34 90 top
SP2  120.65,35.56 90 top
ST7735LCD  90.17,17.78 90 top
TP9  52.07,49.53 0 top
TP17  104.14,22.86 180 top
TP18  104.14,6.35 0 top
U$1  10.16,128.27 270 top
U$2  6.35,67.31 0 top
U$3  114.3,72.39 90 top
ULN1  110.49,102.87 90 top
ULN1-GND  73.66,125.73 0 top
ULN2  76.2,101.6 90 top
ULN2-GND  66.04,125.73 0 top
VBUS-5V  54.61,29.21 0 top

### Tracks (layer width: path | path; a pad name or v marks a point on that pad's centre or on a via)
3.3V-FROM-LM2937-OUTPUT  (via drill 0.35)
  Top 0.203: LCD-3.3V.TP ST7735LCD.2
  Top 0.508: ST7735LCD.2 100.33,8.89 v101.6,7.62 | L1-BUTTONS9-16.2 L1-BUTTONS9-16.4 L1-BUTTONS9-16.6 L1-BUTTONS9-16.8 L1-BUTTONS9-16.10 L1-BUTTONS9-16.12 L1-BUTTONS9-16.14 L1-BUTTONS9-16.16 v58.42,148.59 | 3.3V.TP v24.13,43.18 | v26.67,38.1 C5.+ | v26.67,16.51 v22.86,16.51 | v25.4,1.39 v120.65,1.39 v125.61,1.39 | v124.46,151.01 118.61,151.01 118.59,151.02 59.8,151.02 59.69,151.13 v59.69,151.01 | C8.1 v62.23,34.29 | v76.2,29.21 ST7735LCD.10 v93.98,29.21 96.52,31.75 v104.14,31.75 | v69.85,31.75 IC5.8 | C2.1 v109.22,29.21 | ROUND-POT-VOLULME.1 v113.03,15.24 | C1.+ 13.97,116.84 v15.24,118.11 R3.2 v34.29,118.11 | C19.2 v11.43,121.92 | v11.43,124.46 v8.89,124.46 | L1-BUTTONS1-8.16 L1-BUTTONS1-8.14 L1-BUTTONS1-8.12 L1-BUTTONS1-8.10 L1-BUTTONS1-8.8 L1-BUTTONS1-8.6 L1-BUTTONS1-8.4 L1-BUTTONS1-8.2 v35.56,133.35 | FUNCTION-SWITCH.1 v106.68,12.7 | v106.68,17.78 SLIDE-POT-TONE.1
  Bottom 0.508: TP18.TP 102.87,6.35 v101.6,7.62 FUNCTION-SWITCH.1 | v24.13,43.18 22.86,41.91 C5.+ | v26.67,38.1 IC3.3 v26.67,16.51 | v22.86,16.51 22.86,7.16 25.4,4.62 v25.4,1.39 | v125.61,1.39 125.61,149.98 124.46,151.13 v124.46,151.01 | v59.69,151.01 58.42,149.74 v58.42,148.59 L1-BUTTONS1-8.16 | C8.1 v69.85,31.75 | v62.23,34.29 RS.2 | C4.+ v93.98,29.21 | IC5.8 76.2,31.59 v76.2,29.21 | C2.1 v104.14,31.75 | v109.22,29.21 109.22,19.05 SLIDE-POT-TONE.1 v113.03,15.24 | v120.65,1.39 119.38,2.66 ROUND-POT-VOLULME.1 | v15.24,118.11 13.97,119.38 C19.2 U$1.VDD | v11.43,121.92 v11.43,124.46 | v8.89,124.46 U$1.CH_EN | v106.68,12.7 v106.68,17.78 | v34.29,118.11 34.29,132.08 v35.56,133.35
5V-1A-LED-SUPPLY  (via drill 0.35)
  Top 0.508: LEDS9-16.2 LEDS9-16.4 LEDS9-16.6 LEDS9-16.8 LEDS9-16.10 LEDS9-16.12 LEDS9-16.14 LEDS9-16.16 LEDS1-8.2 LEDS1-8.4 LEDS1-8.6 LEDS1-8.8 LEDS1-8.10 LEDS1-8.12 LEDS1-8.14 LEDS1-8.16 124.34,149.86 v124.46,149.74 | v40.64,49.53 TP9.TP | v124.46,2.54 v36.83,2.54
  Bottom 0.508: v40.64,49.53 IC4.3 36.83,41.91 v36.83,2.54 | v124.46,149.74 v124.46,2.54
8266_GPIO_0  (via drill 0.35)
  Top 0.203: v11.43,132.08 v19.05,132.08 | v19.05,125.73 R3.1
  Bottom 0.203: U$1.GPIO_0 v11.43,132.08 | v19.05,132.08 v19.05,125.73
BARREL_JACK_OUT  (via drill 0.35)
  Top 0.508: J1.1 v19.05,11.43 | AMP-MEASURE-PIN.1 v19.05,27.94
  Bottom 0.508: v19.05,11.43 20.32,12.7 BJ-12V.TP 20.32,20.32 POWER-BOARD-JUMPER.1 v19.05,27.94
BASE
  Top 0.203: JP1.3 12.7,39.37 AUDIO-JACK-CONNECTOR.1
CONTROL-SHUNT-DIODE  (via drill 0.35)
  Top 0.203: R4.1 IC1.1 | R2.2 v66.04,59.69
  Bottom 0.203: v66.04,59.69 IC1.1
DAC-REF_IN  (via drill 0.35)
  Top 0.203: v77.47,36.83 IC5.6 | DAC-REF-1.5V.TP v68.58,46.99 v62.23,46.99
  Bottom 0.203: DAC-REF-1.5V.TP v77.47,36.83 | v68.58,46.99 IC1.2 | v62.23,46.99 R4.2 62.23,41.91 RS.1
GND  (via drill 0.35)
  Top 0.508: v16.51,31.75 17.78,33.02 C5.- 25.4,35.56 C3.- | BJ-GND.TP POWER-BOARD-JUMPER.2 | IC6.7 CS1.2 55.88,10.16 v46.99,10.16 | v116.84,12.7 SLIDE-POT-TONE.3 107.95,10.16 v99.06,10.16 | v116.84,20.32 ROUND-POT-VOLULME.3 | v71.12,40.64 74.77,40.64 IC5.5 v81.28,39.37 | R2.1 v93.98,59.69 | C3-TANTALUM.- IC2.1 104.14,54.61 IC2.7 CS.2 | v81.28,49.53 IC1.3 | DAC-GND.TP v81.28,24.13 v86.36,24.13 | C4.- v86.36,36.83 85.09,38.1 v81.28,38.1 | 5V-LED-GND.TP 71.12,6.35 v72.39,5.08 C2-TANTALUMB.- 88.9,5.08 ST7735LCD.1 v96.52,6.35 | IC6.1 72.39,10.16 v73.66,11.43 | v73.66,16.51 v81.28,16.51 | C1.- C19.1 | v3.81,129.54 U$1.GND | U$2.J2-20 v87.63,90.17 v119.38,90.17 | v119.38,59.69 v113.03,59.69 | C9.- v29.21,33.02 | C2-TANTALUM.- v85.09,62.23 | v85.09,77.47 v93.98,77.47 | U$2.J3-22 v13.97,87.63 v45.72,87.63 | v45.72,93.98 v52.07,93.98 | v12.7,114.3 v8.89,114.3 | ULN2-GND.TP ULN1-GND.TP | v73.66,118.11 v87.63,118.11 U$3.J2-20 | ULN2.9 86.8,97.79 v90.17,97.79 | v90.17,113.03 v87.63,113.03
  Bottom 0.508: POWER-BOARD-JUMPER.2 v16.51,31.75 | BJ-GND.TP 5.08,21.1 4.69,20.71 4.69,12.7 J1.2 | CS1.2 57.15,11.43 5V-LED-GND.TP | v46.99,10.16 v46.98,10.17 PS1.2 46.98,20.33 | v116.84,12.7 v116.84,20.32 | IC4.2 43.18,41.91 40.64,39.37 C9.- 40.64,29.21 45.72,24.13 C6.2 46.98,20.33 | v72.39,5.08 71.12,6.35 IC6.1 | 46.98,20.33 48.24,21.59 C7.2 | IC3.2 v29.21,33.02 C3.- | IC1.3 v71.12,40.64 71.12,38.1 C8.2 | C2-TANTALUM.- 93.98,60.96 v93.98,59.69 95.25,58.42 C3-TANTALUM.- | R2.1 v81.28,49.53 | v81.28,24.13 C3-TANTALUMB.- v81.28,16.51 | v86.36,24.13 v86.36,36.83 | v73.66,11.43 v73.66,16.51 | C2.2 LCD-GND.TP v99.06,10.16 96.52,7.62 v96.52,6.35 | C1.- v3.81,129.54 | v87.63,90.17 86.36,91.44 ULN2.9 | v113.03,59.69 CS.2 | ULN1.9 120.65,91.44 v119.38,90.17 v119.38,59.69 | v81.28,39.37 v81.28,38.1 | v85.09,62.23 v85.09,77.47 | v93.98,77.47 U$3.J3-22 | v45.72,87.63 v45.72,93.98 | v52.07,93.98 U$2.J2-20 | v13.97,87.63 12.7,88.9 v12.7,114.3 | v8.89,114.3 C19.1 | ULN1-GND.TP v73.66,118.11 | v90.17,97.79 v90.17,113.03 | v87.63,113.03 v87.63,118.11
JUMPER-BARREL-JACK  (via drill 0.35)
  Top 0.508: v8.89,30.48 v22.86,30.48 | v22.86,22.86 v31.75,22.86 | v53.34,13.97 52.07,12.7 PS1.1 | v53.34,26.67 v46.99,26.67 | v45.72,35.56 C3.+ | v34.29,30.48 33.02,30.48 IC3.1
  Bottom 0.508: AMP-MEASURE-PIN.2 v8.89,30.48 | v22.86,30.48 v22.86,22.86 | v31.75,22.86 IC3.1 | v53.34,13.97 C7.1 v53.34,26.67 | v46.99,26.67 45.72,27.94 C9.+ v45.72,35.56 IC4.1 | C3.+ v34.29,30.48
L1-PA2  (via drill 0.35)
  Top 0.203: ST7735LCD.8 v87.63,24.13 | v87.63,25.4 v80.01,25.4 | v55.88,66.04 53.34,66.04 U$2.J2-11 | v80.01,30.48 v55.88,30.48
  Bottom 0.203: v87.63,24.13 v87.63,25.4 | v80.01,25.4 v80.01,30.48 | v55.88,30.48 v55.88,66.04
L1-PA3  (via drill 0.35)
  Top 0.203: ST7735LCD.6 v95.25,19.05 | v95.25,49.53 v88.9,49.53 | v88.9,67.31 v54.61,67.31
  Bottom 0.203: v95.25,19.05 95.25,34.29 96.52,35.56 96.52,39.37 95.25,40.64 v95.25,49.53 | v88.9,49.53 v88.9,67.31 | v54.61,67.31 U$2.J2-12
L1-PA4  (via drill 0.35)
  Top 0.203: ST7735LCD.9 v97.79,26.67 | v97.79,39.37 v86.36,39.37 | v86.36,72.39 U$2.J2-13
  Bottom 0.203: v97.79,26.67 v97.79,39.37 | v86.36,39.37 86.36,44.45 87.63,45.72 87.63,66.04 86.36,67.31 v86.36,72.39
L1-PA5  (via drill 0.35)
  Top 0.203: ST7735LCD.7 v83.82,21.59 | v83.82,26.67 v78.74,26.67 | v78.74,33.02 v48.26,33.02 | v48.26,57.15 v2.54,57.15 | v2.54,72.39 U$2.J1-8
  Bottom 0.203: v83.82,21.59 v83.82,26.67 | v78.74,26.67 v78.74,33.02 | v48.26,33.02 v48.26,57.15 | v2.54,57.15 v2.54,72.39
L1-PA6  (via drill 0.35)
  Top 0.203: ST7735LCD.4 v83.82,13.97 | v82.55,64.77 v3.81,64.77
  Bottom 0.203: v83.82,13.97 82.55,15.24 v82.55,64.77 | v3.81,64.77 3.81,67.31 U$2.J1-9
L1-PA7  (via drill 0.35)
  Top 0.203: ST7735LCD.3 v77.47,11.43 | v77.47,26.67 v57.15,26.67 | v57.15,58.42 v6.35,58.42
  Bottom 0.203: v77.47,11.43 77.47,23.51 77.41,23.58 77.41,24.68 77.47,24.75 v77.47,26.67 | v57.15,26.67 v57.15,58.42 | v6.35,58.42 U$2.J1-10
L1-PB0  (via drill 0.35)
  Top 0.203: ST7735LCD.5 v92.71,16.51 | v92.71,82.55 v54.61,82.55 | v54.61,83.82 7.62,83.82 U$2.J1-3
  Bottom 0.203: v92.71,16.51 v92.71,82.55 | v54.61,82.55 v54.61,83.82
L1-PB1  (via drill 0.35)
  Top 0.203: U$2.J1-4 v1.39,82.55 | v1.39,111.76 v41.91,111.76
  Bottom 0.203: v1.39,82.55 1.27,82.67 1.27,111.76 v1.39,111.76 | v41.91,111.76 41.91,121.92 43.18,121.92 L1-BUTTONS1-8.3
L1-PB2  (via drill 0.35)
  Top 0.203: U$2.J2-19 v55.88,87.63 | v55.88,124.46 v40.64,124.46
  Bottom 0.203: v55.88,87.63 v55.88,124.46 | v40.64,124.46 L1-BUTTONS1-8.1
L1-PB3  (via drill 0.35)
  Top 0.203: U$2.J4-38 v46.99,85.09 | v46.99,90.17 v20.32,90.17
  Bottom 0.203: L1-BUTTONS9-16.1 24.13,139.7 20.32,139.7 v20.32,90.17 | v46.99,85.09 v46.99,90.17
L1-PB5  (via drill 0.35)
  Top 0.203: SLIDE-POT-TONE.2 v113.03,17.78 | v113.03,48.26 v115.57,48.26 | v115.57,71.12 v116.84,71.12 | v116.84,87.63 115.57,86.36 7.62,86.36 U$2.J1-2
  Bottom 0.203: v113.03,17.78 v113.03,48.26 | v116.84,71.12 v116.84,87.63 | v115.57,48.26 v115.57,71.12
L1-PB6  (via drill 0.35)
  Top 0.203: U$2.J2-14 v58.42,74.93 | v58.42,123.19 v60.96,123.19 | v60.96,146.05 L1-BUTTONS9-16.15
  Bottom 0.203: v58.42,74.93 v58.42,123.19 | v60.96,123.19 v60.96,146.05
L1-PB7  (via drill 0.35)
  Top 0.203: U$2.J2-15 v62.23,77.47 | v62.23,125.73 v38.1,125.73
  Bottom 0.203: v62.23,77.47 v62.23,125.73 | v38.1,125.73 38.1,135.89 39.37,135.89 L1-BUTTONS9-16.13
L1-PC4  (via drill 0.35)
  Top 0.203: U$2.J4-37 v38.1,82.55 | v38.1,124.46 v30.48,124.46 | v30.48,137.16 v26.67,137.16
  Bottom 0.203: v38.1,82.55 v38.1,124.46 | v30.48,124.46 v30.48,137.16 | v26.67,137.16 L1-BUTTONS9-16.3
L1-PC5  (via drill 0.35)
  Top 0.203: U$2.J4-36 v45.72,80.01 | v45.72,85.09 v29.21,85.09
  Bottom 0.203: v45.72,80.01 v45.72,85.09 | v29.21,85.09 L1-BUTTONS9-16.5
L1-PC6  (via drill 0.35)
  Top 0.203: U$2.J4-35 v31.75,77.47
  Bottom 0.203: v31.75,77.47 L1-BUTTONS9-16.7
L1-PC7  (via drill 0.35)
  Top 0.203: U$2.J4-34 v33.02,74.93
  Bottom 0.203: v33.02,74.93 33.02,140.97 34.29,140.97 L1-BUTTONS9-16.9
L1-PD0  (via drill 0.35)
  Top 0.203: IC5.2 v78.74,34.29 | v78.74,85.09 v54.61,85.09 | v54.61,91.44 v11.43,91.44 | v11.43,85.09 U$2.J3-23
  Bottom 0.203: v78.74,34.29 78.74,44.45 80.01,45.72 80.01,55.88 78.74,57.15 v78.74,85.09 | v54.61,85.09 v54.61,91.44 | v11.43,91.44 v11.43,85.09
L1-PD1  (via drill 0.35)
  Top 0.203: IC5.3 v80.01,36.83 | v80.01,44.45 v64.77,44.45 | v64.77,38.1 v34.29,38.1 | v34.29,82.55 U$2.J3-24
  Bottom 0.203: v80.01,36.83 v80.01,44.45 | v64.77,44.45 v64.77,38.1 | v34.29,38.1 v34.29,82.55
L1-PD2  (via drill 0.35)
  Top 0.203: U$2.J3-25 v43.18,80.01 | v43.18,119.38 v45.72,119.38
  Bottom 0.203: v43.18,80.01 v43.18,119.38 | v45.72,119.38 L1-BUTTONS1-8.5
L1-PD3  (via drill 0.35)
  Top 0.203: IC5.1 v80.01,31.75 | v80.01,35.56 v73.66,35.56 | v73.66,76.2 v11.43,76.2 | v11.43,77.47 U$2.J3-26
  Bottom 0.203: v80.01,31.75 v80.01,35.56 | v73.66,35.56 v73.66,76.2 | v11.43,76.2 v11.43,77.47
L1-PD6  (via drill 0.35)
  Top 0.203: v104.14,15.24 FUNCTION-SWITCH.2 | TP17.TP v111.76,22.86 | v110.49,66.04 v57.15,66.04 | v57.15,59.69 v46.99,59.69 | v46.99,72.39 U$2.J4-33
  Bottom 0.203: TP17.TP v104.14,15.24 | v111.76,22.86 111.76,46.99 110.49,48.26 v110.49,66.04 | v57.15,66.04 v57.15,59.69 | v46.99,59.69 v46.99,72.39
L1-PE0  (via drill 0.35)
  Top 0.203: v8.89,135.89 v27.94,135.89 | v27.94,99.06 v57.15,99.06 | v57.15,81.28 v54.61,81.28
  Bottom 0.203: U$1.GPIO_2 v8.89,135.89 | v27.94,135.89 v27.94,99.06 | U$2.J2-18 53.34,85.09 53.34,81.28 v54.61,81.28 | v57.15,99.06 v57.15,81.28
L1-PE1  (via drill 0.35)
  Top 0.203: U$2.J3-27 v15.24,74.93 | v15.24,115.57 v17.78,115.57 | v17.78,134.62 10.16,134.62 10.16,128.27 U$1.RST_B
  Bottom 0.203: v15.24,74.93 v15.24,115.57 | v17.78,115.57 v17.78,134.62
L1-PE2  (via drill 0.35)
  Top 0.203: ROUND-POT-VOLULME.2 v121.92,17.78 | v123.19,69.85 55.88,69.85 54.61,71.12 10.16,71.12 U$2.J3-28
  Bottom 0.203: v123.19,69.85 123.19,19.05 v121.92,17.78
L1-PE3  (via drill 0.35)
  Top 0.203: U$2.J3-29 v39.37,69.85 | v39.37,116.84 v50.8,116.84
  Bottom 0.203: v39.37,69.85 v39.37,116.84 | v50.8,116.84 L1-BUTTONS1-8.9
L1-PE4  (via drill 0.35)
  Top 0.203: v6.35,95.25 v2.54,95.25 | v2.54,80.01 U$2.J1-5
  Bottom 0.203: U$1.TXD v6.35,95.25 | v2.54,95.25 v2.54,80.01
L1-PE5  (via drill 0.35)
  Top 0.203: U$1.RXD v16.51,129.54 | v16.51,93.98 v3.81,93.98 | v3.81,77.47 U$2.J1-6
  Bottom 0.203: v16.51,129.54 v16.51,93.98 | v3.81,93.98 v3.81,77.47
L1-PF0  (via drill 0.35)
  Top 0.203: U$2.J2-17 50.8,81.28 v41.91,81.28 | v41.91,109.22 v48.26,109.22
  Bottom 0.203: v41.91,81.28 v41.91,109.22 | v48.26,109.22 L1-BUTTONS1-8.7
L1-PF1  (via drill 0.35)
  Top 0.203: U$2.J3-30 10.16,68.58 v44.45,68.58 | v44.45,118.11 v53.34,118.11
  Bottom 0.203: v44.45,68.58 v44.45,118.11 | v53.34,118.11 L1-BUTTONS1-8.11
L1-PF2  (via drill 0.35)
  Top 0.203: v54.61,96.52 v49.53,96.52
  Bottom 0.203: L1-BUTTONS1-8.13 55.88,127 54.61,127 v54.61,96.52 | v49.53,96.52 U$2.J4-40
L1-PF3  (via drill 0.35)
  Top 0.203: v40.64,88.9 46.99,88.9 46.99,87.63 U$2.J4-39 | v40.64,123.19 v57.15,123.19
  Bottom 0.203: v40.64,88.9 v40.64,123.19 | v57.15,123.19 57.15,129.54 L1-BUTTONS1-8.15
L1-PF4  (via drill 0.35)
  Top 0.203: U$2.J4-31 v36.83,67.31
  Bottom 0.203: v36.83,67.31 L1-BUTTONS9-16.11
L2-PA2  (via drill 0.35)
  Top 0.203: v121.92,118.11 U$3.J2-11
  Bottom 0.203: L2-BUTTONS-IN9-16.8 v121.92,118.11
L2-PA3  (via drill 0.35)
  Top 0.203: v119.38,120.65 v111.76,120.65
  Bottom 0.203: L2-BUTTONS-IN9-16.7 v119.38,120.65 | v111.76,120.65 U$3.J2-12
L2-PA4  (via drill 0.35)
  Top 0.203: v116.84,121.92 v109.22,121.92
  Bottom 0.203: L2-BUTTONS-IN9-16.6 v116.84,121.92 | v109.22,121.92 U$3.J2-13
L2-PA5  (via drill 0.35)
  Top 0.203: v110.49,87.63 v114.3,87.63
  Bottom 0.203: U$3.J1-8 110.49,73.66 v110.49,87.63 | ULN1.7 115.57,88.9 v114.3,87.63
L2-PA6  (via drill 0.35)
  Top 0.203: v113.03,85.09 v118.11,85.09
  Bottom 0.203: U$3.J1-9 113.03,73.66 v113.03,85.09 | v118.11,85.09 ULN1.8
L2-PA7  (via drill 0.35)
  Top 0.203: U$3.J1-10 115.57,72.39 v115.57,77.47 | v115.57,81.28 v85.09,81.28 | v85.09,93.98 66.04,93.98 ULN2.1
  Bottom 0.203: v115.57,77.47 v115.57,81.28 | v85.09,81.28 v85.09,93.98
L2-PB0  (via drill 0.35)
  Top 0.203: v97.79,95.25 102.87,95.25 ULN1.2
  Bottom 0.203: U$3.J1-3 97.79,73.66 v97.79,95.25
L2-PB1  (via drill 0.35)
  Top 0.203: v100.33,93.98 105.41,93.98 ULN1.3
  Bottom 0.203: U$3.J1-4 100.33,73.66 v100.33,93.98
L2-PB3  (via drill 0.35)
  Top 0.203: v87.63,120.65 v95.25,120.65
  Bottom 0.203: L2-BUTTONS-IN1-8.3 v87.63,120.65 | v95.25,120.65 95.25,116.84 U$3.J4-38
L2-PB4  (via drill 0.35)
  Top 0.203: v107.95,88.9 v111.76,88.9
  Bottom 0.203: U$3.J1-7 107.95,73.66 v107.95,88.9 | ULN1.6 113.03,90.17 v111.76,88.9
L2-PB5  (via drill 0.35)
  Top 0.203: v99.06,96.52 v95.25,96.52
  Bottom 0.203: ULN1.1 100.33,97.79 v99.06,96.52 | v95.25,96.52 95.25,73.66 U$3.J1-2
L2-PB6  (via drill 0.35)
  Top 0.203: v114.3,123.19 v106.68,123.19
  Bottom 0.203: L2-BUTTONS-IN9-16.5 v114.3,123.19 | v106.68,123.19 U$3.J2-14
L2-PB7  (via drill 0.35)
  Top 0.203: v111.76,124.46 v104.14,124.46
  Bottom 0.203: L2-BUTTONS-IN9-16.4 v111.76,124.46 | v104.14,124.46 U$3.J2-15
L2-PC4  (via drill 0.35)
  Top 0.203: v91.44,109.22 v99.06,109.22
  Bottom 0.203: L2-BUTTONS-IN1-8.4 90.17,114.3 91.44,114.3 v91.44,109.22 | v99.06,109.22 U$3.J4-37
L2-PC5  (via drill 0.35)
  Top 0.203: v92.71,111.76 v101.6,111.76
  Bottom 0.203: L2-BUTTONS-IN1-8.5 v92.71,111.76 | v101.6,111.76 U$3.J4-36
L2-PC6
  Top 0.203: U$3.J4-35 102.87,116.84 102.87,121.92 95.25,121.92 L2-BUTTONS-IN1-8.6
L2-PC7  (via drill 0.35)
  Top 0.203: v96.52,123.19 v105.41,123.19
  Bottom 0.203: L2-BUTTONS-IN1-8.7 96.52,127 v96.52,123.19 | v105.41,123.19 105.41,116.84 U$3.J4-34
L2-PD1  (via drill 0.35)
  Top 0.203: v99.06,92.71 v69.85,92.71
  Bottom 0.203: U$3.J3-24 v99.06,92.71 | ULN2.2 68.58,93.98 v69.85,92.71
L2-PD2  (via drill 0.35)
  Top 0.203: v101.6,91.44 v72.39,91.44
  Bottom 0.203: U$3.J3-25 v101.6,91.44 | ULN2.3 71.12,92.71 v72.39,91.44
L2-PD3  (via drill 0.35)
  Top 0.203: v104.14,88.9 v74.93,88.9
  Bottom 0.203: U$3.J3-26 v104.14,88.9 | ULN2.4 73.66,90.17 v74.93,88.9
L2-PD6  (via drill 0.35)
  Top 0.203: U$3.J4-33 109.22,113.03 95.25,113.03 95.25,119.38 v86.36,119.38 | v88.9,132.08 v100.33,132.08
  Bottom 0.203: v86.36,119.38 86.36,129.54 v88.9,132.08 | v100.33,132.08 L2-BUTTONS-IN1-8.8
L2-PD7  (via drill 0.35)
  Top 0.203: v111.76,111.76 v120.65,111.76 | v120.65,132.08 v104.14,132.08
  Bottom 0.203: U$3.J4-32 v111.76,111.76 | v120.65,111.76 v120.65,132.08 | v104.14,132.08 L2-BUTTONS-IN9-16.1
L2-PE1  (via drill 0.35)
  Top 0.203: v106.68,87.63 v77.47,87.63
  Bottom 0.203: U$3.J3-27 v106.68,87.63 | ULN2.5 76.2,88.9 v77.47,87.63
L2-PE2  (via drill 0.35)
  Top 0.203: v109.22,85.09 v80.01,85.09
  Bottom 0.203: U$3.J3-28 v109.22,85.09 | ULN2.6 78.74,86.36 v80.01,85.09
L2-PE3  (via drill 0.35)
  Top 0.203: v111.76,83.82 v82.55,83.82
  Bottom 0.203: U$3.J3-29 v111.76,83.82 | ULN2.7 81.28,85.09 v82.55,83.82
L2-PE4  (via drill 0.35)
  Top 0.203: v102.87,92.71 v106.68,92.71
  Bottom 0.203: U$3.J1-5 102.87,73.66 v102.87,92.71 | ULN1.4 107.95,93.98 v106.68,92.71
L2-PE5  (via drill 0.35)
  Top 0.203: v105.41,91.44 v109.22,91.44
  Bottom 0.203: U$3.J1-6 105.41,73.66 v105.41,91.44 | ULN1.5 110.49,92.71 v109.22,91.44
L2-PF0  (via drill 0.35)
  Top 0.203: v109.22,125.73 v99.06,125.73
  Bottom 0.203: L2-BUTTONS-IN9-16.3 v109.22,125.73 | v99.06,125.73 U$3.J2-17
L2-PF1  (via drill 0.35)
  Top 0.203: v114.3,82.55 v121.92,82.55 | v121.92,101.6 v85.09,101.6
  Bottom 0.203: U$3.J3-30 v114.3,82.55 | v85.09,101.6 83.82,100.33 ULN2.8 | v121.92,82.55 v121.92,101.6
L2-PF2  (via drill 0.35)
  Top 0.203: v82.55,120.65 v85.09,120.65 | v85.09,115.57 U$3.J4-40
  Bottom 0.203: L2-BUTTONS-IN1-8.1 v82.55,120.65 | v85.09,120.65 v85.09,115.57
L2-PF3  (via drill 0.35)
  Top 0.203: v93.98,110.49 v83.82,110.49
  Bottom 0.203: U$3.J4-39 v93.98,110.49 | v83.82,110.49 83.82,124.46 85.09,125.73 L2-BUTTONS-IN1-8.2
L2-PF4  (via drill 0.35)
  Top 0.203: U$3.J4-31 115.57,116.84 v116.84,116.84 | v116.84,119.38 v118.11,119.38 | v118.11,130.81 v106.68,130.81
  Bottom 0.203: v116.84,116.84 v116.84,119.38 | v118.11,119.38 v118.11,130.81 | v106.68,130.81 L2-BUTTONS-IN9-16.2
LED1-TO-RESISTOR
  Top 0.203: LEDS1-8.1 99.06,147.32 R21.2
LED2-TO-RESISTOR
  Top 0.203: LEDS1-8.3 102.87,146.05 R22.2
LED3-TO-RESISTOR
  Top 0.203: LEDS1-8.5 105.41,146.05 R23.2
LED4-TO-RESISTOR
  Top 0.203: LEDS1-8.7 107.95,143.51 R24.2
LED5-TO-RESISTOR
  Top 0.203: LEDS1-8.9 R25.2
LED6-TO-RESISTOR
  Top 0.203: LEDS1-8.11 113.03,143.51 R26.2
LED7-TO-RESISTOR
  Top 0.203: LEDS1-8.13 118.11,144.78 R27.2
LED8-TO-RESISTOR
  Top 0.203: LEDS1-8.15 121.92,143.51 R28.2
LED9-TO-RESISTOR  (via drill 0.35)
  Top 0.203: LEDS9-16.1 v63.5,147.32
  Bottom 0.203: v63.5,147.32 R29.2
LED10-TO-RESISTOR  (via drill 0.35)
  Top 0.203: v71.12,144.78 67.31,144.78 R30.2
  Bottom 0.203: LEDS9-16.3 v71.12,144.78
LED11-TO-RESISTOR  (via drill 0.35)
  Top 0.203: v73.66,143.51 71.12,143.51 R31.2
  Bottom 0.203: LEDS9-16.5 v73.66,143.51
LED12-TO-RESISTOR
  Bottom 0.203: LEDS9-16.7 76.2,143.51 R32.2
LED13-TO-RESISTOR
  Bottom 0.203: LEDS9-16.9 R33.2
LED14-TO-RESISTOR
  Bottom 0.203: LEDS9-16.11 81.28,143.51 R34.2
LED15-TO-RESISTOR  (via drill 0.35)
  Top 0.203: v83.82,143.51 R35.2
  Bottom 0.203: LEDS9-16.13 v83.82,143.51
LED16-TO-RESISTOR
  Top 0.203: LEDS9-16.15 90.17,143.51 R36.2
MC34-INA
  Top 0.203: RF.1 101.6,43.18 IC2-IN.TP 96.52,41.91 R5.2
  Bottom 0.203: RF.1 102.87,48.26 IC2.4
MC34-INB  (via drill 0.35)
  Top 0.203: R1.2 73.66,17.78 IC6.4 | IC6-IN.TP v71.12,20.32
  Bottom 0.203: v71.12,20.32 IC6.4 | RF1.1 IC6-IN.TP
MC34-INPUT2  (via drill 0.35)
  Top 0.203: v100.33,54.61 IC2.2
  Bottom 0.203: C2-TANTALUM.+ v100.33,54.61
MC34-INPUT2B  (via drill 0.35)
  Top 0.203: IC6.2 v76.2,12.7
  Bottom 0.203: v76.2,12.7 C2-TANTALUMB.+
MC34-INPUT3
  Top 0.203: C3-TANTALUM.+ IC2.3
MC34-INPUT3B
  Top 0.203: IC6.3 80.01,15.24 C3-TANTALUMB.+
OUTA
  Bottom 0.203: C1-CERAMIC.1 83.98,51.91 IC5.4
OUTB  (via drill 0.35)
  Top 0.203: IC5.7 v72.39,34.29 | v72.39,21.59 67.31,21.59 C1-CERAMIC1.1
  Bottom 0.203: v72.39,34.29 v72.39,21.59
POT-TO-RESISTOR_DAC-TO-OP-AMPA  (via drill 0.35)
  Top 0.203: R5.1 v86.36,46.99
  Bottom 0.203: v86.36,46.99 C1-CERAMIC.2
POT-TO-RESISTOR_DAC-TO-OP-AMPB  (via drill 0.35)
  Top 0.203: C1-CERAMIC1.2 v73.66,22.86
  Bottom 0.203: v73.66,22.86 R1.1
R21-TO-ULN  (via drill 0.35)
  Top 0.203: v99.06,130.81 v95.25,130.81
  Bottom 0.203: ULN1.18 99.06,107.12 97.79,108.39 97.79,125.73 99.06,127 v99.06,130.81 | v95.25,130.81 R21.1
R22-TO-ULN  (via drill 0.35)
  Top 0.203: v100.33,124.46 v101.6,124.46
  Bottom 0.203: ULN1.17 100.33,109.66 v100.33,124.46 | v101.6,124.46 101.6,133.35 100.33,134.62 R22.1
R23-TO-ULN
  Bottom 0.203: ULN1.16 102.87,109.66 R23.1
R24-TO-ULN
  Bottom 0.203: ULN1.15 107.95,133.35 R24.1
R25-TO-ULN
  Bottom 0.203: ULN1.14 R25.1
R26-TO-ULN
  Bottom 0.203: ULN1.13 113.03,133.35 R26.1
R27-TO-ULN
  Bottom 0.203: ULN1.12 115.57,133.35 R27.1
R28-TO-ULN  (via drill 0.35)
  Top 0.203: v118.11,116.84 v123.19,116.84
  Bottom 0.203: ULN1.11 v118.11,116.84 | v123.19,116.84 123.19,134.62 R28.1
R29-TO-ULN  (via drill 0.35)
  Top 0.203: v63.5,106.68 64.33,105.85 ULN2.18
  Bottom 0.203: R29.1 v63.5,106.68
R30-TO-ULN
  Bottom 0.203: ULN2.17 68.58,133.35 R30.1
R31-TO-ULN
  Bottom 0.203: R31.1 ULN2.16
R32-TO-ULN  (via drill 0.35)
  Top 0.203: v76.2,115.57 v73.66,115.57
  Bottom 0.203: R32.1 76.2,133.35 v76.2,115.57 | v73.66,115.57 ULN2.15
R33-TO-ULN
  Bottom 0.203: R33.1 78.74,115.57 76.2,113.03 ULN2.14
R34-TO-ULN  (via drill 0.35)
  Top 0.203: v82.55,132.08 v80.01,132.08
  Bottom 0.203: R34.1 v82.55,132.08 | ULN2.13 80.01,107.12 v80.01,132.08
R35-TO-ULN  (via drill 0.35)
  Top 0.203: v86.36,130.81 v77.47,130.81 | v77.47,116.84 v82.55,116.84
  Bottom 0.203: v77.47,130.81 v77.47,116.84 | v82.55,116.84 81.28,115.57 ULN2.12 | R35.1 v86.36,130.81
R36-TO-ULN  (via drill 0.35)
  Top 0.203: v88.9,107.95 83.82,107.95 ULN2.11
  Bottom 0.203: R36.1 90.17,132.08 88.9,130.81 v88.9,107.95
RING  (via drill 0.35)
  Top 0.203: JP1.1 v15.24,44.45
  Bottom 0.203: v15.24,44.45 AUDIO-JACK-CONNECTOR.3
TIP  (via drill 0.35)
  Top 0.203: JP1.2 v17.78,34.29
  Bottom 0.203: v17.78,34.29 17.78,36.83 AUDIO-JACK-CONNECTOR.2
TO-SPEAKER-INPUT-1A  (via drill 0.35)
  Top 0.203: IC2.5 v120.65,49.53
  Bottom 0.203: RF.2 109.22,45.72 IC2.5 | v120.65,49.53 SP1.1
TO-SPEAKER-INPUT-1B  (via drill 0.35)
  Top 0.203: SP2.1 v87.63,34.29 | v87.63,27.94 RF1.2
  Bottom 0.203: RF1.2 64.77,19.05 IC6.5 | v87.63,34.29 v87.63,27.94
TO-SPEAKER-INPUT-2A  (via drill 0.35)
  Top 0.203: v120.65,57.15 IC2.8
  Bottom 0.203: SP1.2 v120.65,57.15
TO-SPEAKER-INPUT-2B  (via drill 0.35)
  Top 0.203: IC6.8 v68.58,10.16 | v67.31,43.18 v93.98,43.18 | v93.98,46.99 v120.65,46.99
  Bottom 0.203: v68.58,10.16 67.31,11.43 v67.31,43.18 | v93.98,43.18 v93.98,46.99 | v120.65,46.99 SP2.2
VBUS-SUPPLY  (via drill 0.35)
  Top 0.508: IC6.6 CS1.1 v44.45,15.24 | v44.45,15.24 v40.64,15.24 | v40.64,26.67 43.18,29.21 VBUS-5V.TP 52.07,31.75 v50.8,31.75 | IC2.6 CS.1 v116.84,52.07 | U$3.J3-21 v87.63,74.93 | v116.84,68.58 v87.63,68.58 v62.23,68.58 | U$2.J3-21 v16.51,90.17 | v16.51,48.26 v49.53,48.26 | v50.8,17.78 44.45,17.78 v44.45,15.24 | PS1.3 44.45,12.72 v44.45,15.24 | v62.23,53.34 v49.53,53.34
  Bottom 0.508: v40.64,15.24 C6.1 v40.64,26.67 | v87.63,74.93 v87.63,68.58 | v116.84,68.58 v116.84,52.07 | v16.51,90.17 v16.51,48.26 | v50.8,17.78 v50.8,31.75 50.8,46.99 v49.53,48.26 v49.53,53.34 | v62.23,68.58 v62.23,53.34

### Text on the board
tPlace: 3.3V supply ^ | <5V power to LEDs> | L1-PB3 | L1-PC4 | L1-PC5 | L1-PC6 | L1-PC7 | L1-PF4 | L1-PB7 | L1-PB6 | Designer: Ryan Arnold / Team: Tyler Laue, / Ian SymSmith, Zakky Mommin / TA: Jared McArthur / March 30, 2022 / Project name: "MIDI Madness" / MIDI sound board with / LEDs and Sound | L1-PB2 | L1-PB1 | L1-PD2 | L1-PF0 | L1-PE3 | L1-PF1 | L1-PF2 | L1-PF3 | Input | Output | Input | VCC | L1-PA4 | L1-PA2 | L1-PA5 | GND | 3.3V | L1-PA3 | L1-PD6 | L1-PE2 | L1-PB0 | L1-PB5 | 3.3V | L1-PA6 | Input | Output | L1-PA7 | 3.3V | GND | 3.3V | GND
bPlace: Designer: Ryan Arnold / Team: Tyler Laue, / Ian SymSmith, Zakky Mommin / TA: Jared McArthur / March 30, 2022 / Project name: "MIDI Madness" / MIDI sound board with / LEDs and Sound